# Altium project ZYNQ7020.PrjPcb (part 1 of 3)
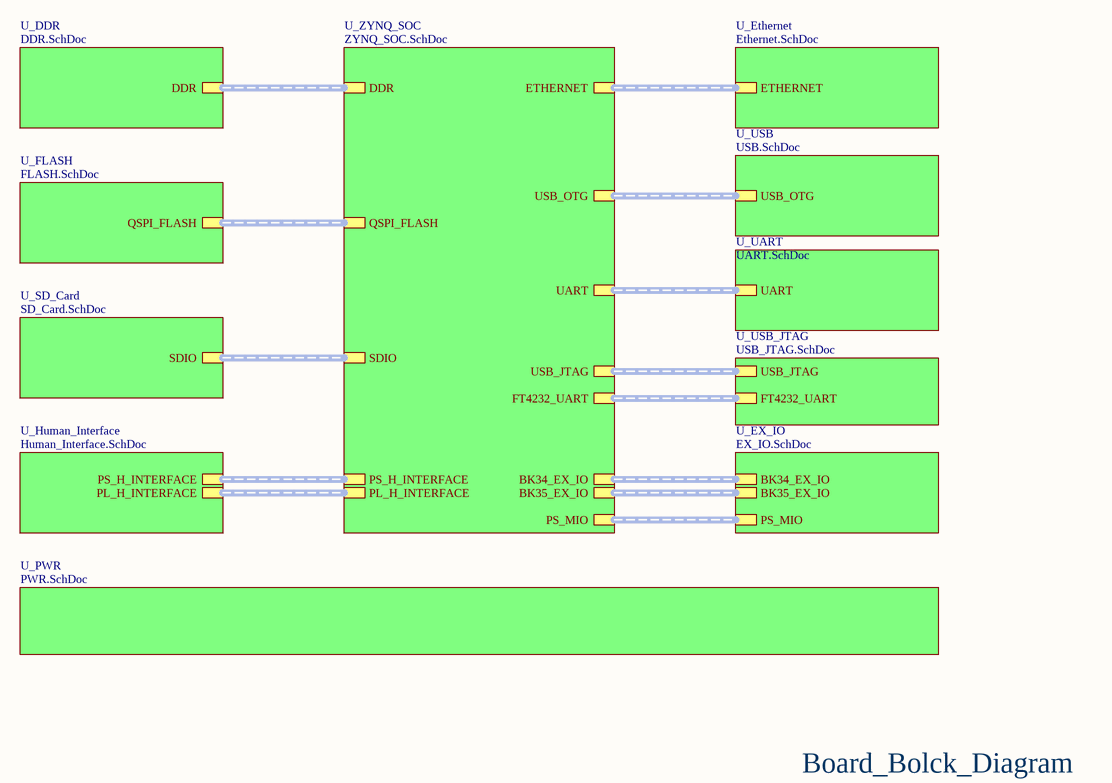
[diagram p0: ZYNQ.SchDoc]
16 sheets, 485 parts. Net scope: hierarchical (ports join the sheet entries above them; power ports are global).
Board file: ZYNQ7020.PcbDoc
Sheets:
  ZYNQ.SchDoc
    U_ZYNQ_SOC = ZYNQ_SOC.SchDoc
      U_ZYNQ_SOC_ARM = ZYNQ_SOC_ARM.SchDoc
      U_ZYNQ_SOC_FPGA = ZYNQ_SOC_FPGA.SchDoc
      U_ZYNQ_SOC_JTAG = ZYNQ_SOC_JTAG.SchDoc
      U_ZYNQ_SOC_PWR = ZYNQ_SOC_PWR.SchDoc
    U_EX_IO = EX_IO.SchDoc
    U_FLASH = FLASH.SchDoc
    U_DDR = DDR.SchDoc
    U_Human_Interface = Human_Interface.SchDoc
    U_UART = UART.SchDoc
    U_SD_Card = SD_Card.SchDoc
    U_PWR = PWR.SchDoc
    U_Ethernet = Ethernet.SchDoc
    U_USB = USB.SchDoc
    U_USB_JTAG = USB_JTAG.SchDoc

## Sheet ZYNQ.SchDoc
size A4

### Sub-sheets
U_DDR = DDR.SchDoc: DDR (harness DDR)
U_Ethernet = Ethernet.SchDoc: ETHERNET (harness ETHERNET)
U_EX_IO = EX_IO.SchDoc: PS_MIO (harness PS_MIO), BK35_EX_IO (harness BK35_EX_IO), BK34_EX_IO (harness BK34_EX_IO)
U_FLASH = FLASH.SchDoc: QSPI_FLASH (harness QSPI_FLASH)
U_Human_Interface = Human_Interface.SchDoc: PS_H_INTERFACE (harness PS_H_INTERFACE), PL_H_INTERFACE (harness PL_H_INTERFACE)
U_PWR = PWR.SchDoc: no entries
U_SD_Card = SD_Card.SchDoc: SDIO (harness SDIO)
U_UART = UART.SchDoc: UART (harness UART)
U_USB = USB.SchDoc: USB_OTG (harness USB_OTG)
U_USB_JTAG = USB_JTAG.SchDoc: FT4232_UART (harness FT4232_UART), USB_JTAG (harness USB_JTAG)
U_ZYNQ_SOC = ZYNQ_SOC.SchDoc: QSPI_FLASH, DDR, PL_H_INTERFACE, UART, PS_H_INTERFACE, SDIO, BK34_EX_IO, PS_MIO, BK35_EX_IO, ETHERNET, USB_OTG, USB_JTAG, FT4232_UART

### Buses and harness runs
harness sheet U_DDR/DDR = sheet U_ZYNQ_SOC/DDR
harness sheet U_Ethernet/ETHERNET = sheet U_ZYNQ_SOC/ETHERNET
harness sheet U_EX_IO/BK34_EX_IO = sheet U_ZYNQ_SOC/BK34_EX_IO
harness sheet U_EX_IO/BK35_EX_IO = sheet U_ZYNQ_SOC/BK35_EX_IO
harness sheet U_EX_IO/PS_MIO = sheet U_ZYNQ_SOC/PS_MIO
harness sheet U_FLASH/QSPI_FLASH = sheet U_ZYNQ_SOC/QSPI_FLASH
harness sheet U_Human_Interface/PL_H_INTERFACE = sheet U_ZYNQ_SOC/PL_H_INTERFACE
harness sheet U_Human_Interface/PS_H_INTERFACE = sheet U_ZYNQ_SOC/PS_H_INTERFACE
harness sheet U_SD_Card/SDIO = sheet U_ZYNQ_SOC/SDIO
harness sheet U_UART/UART = sheet U_ZYNQ_SOC/UART
harness sheet U_USB/USB_OTG = sheet U_ZYNQ_SOC/USB_OTG
harness sheet U_USB_JTAG/FT4232_UART = sheet U_ZYNQ_SOC/FT4232_UART
harness sheet U_USB_JTAG/USB_JTAG = sheet U_ZYNQ_SOC/USB_JTAG

### Notes on the sheet
- Board_Bolck_Diagram

## Sheet ZYNQ_SOC.SchDoc
size A4
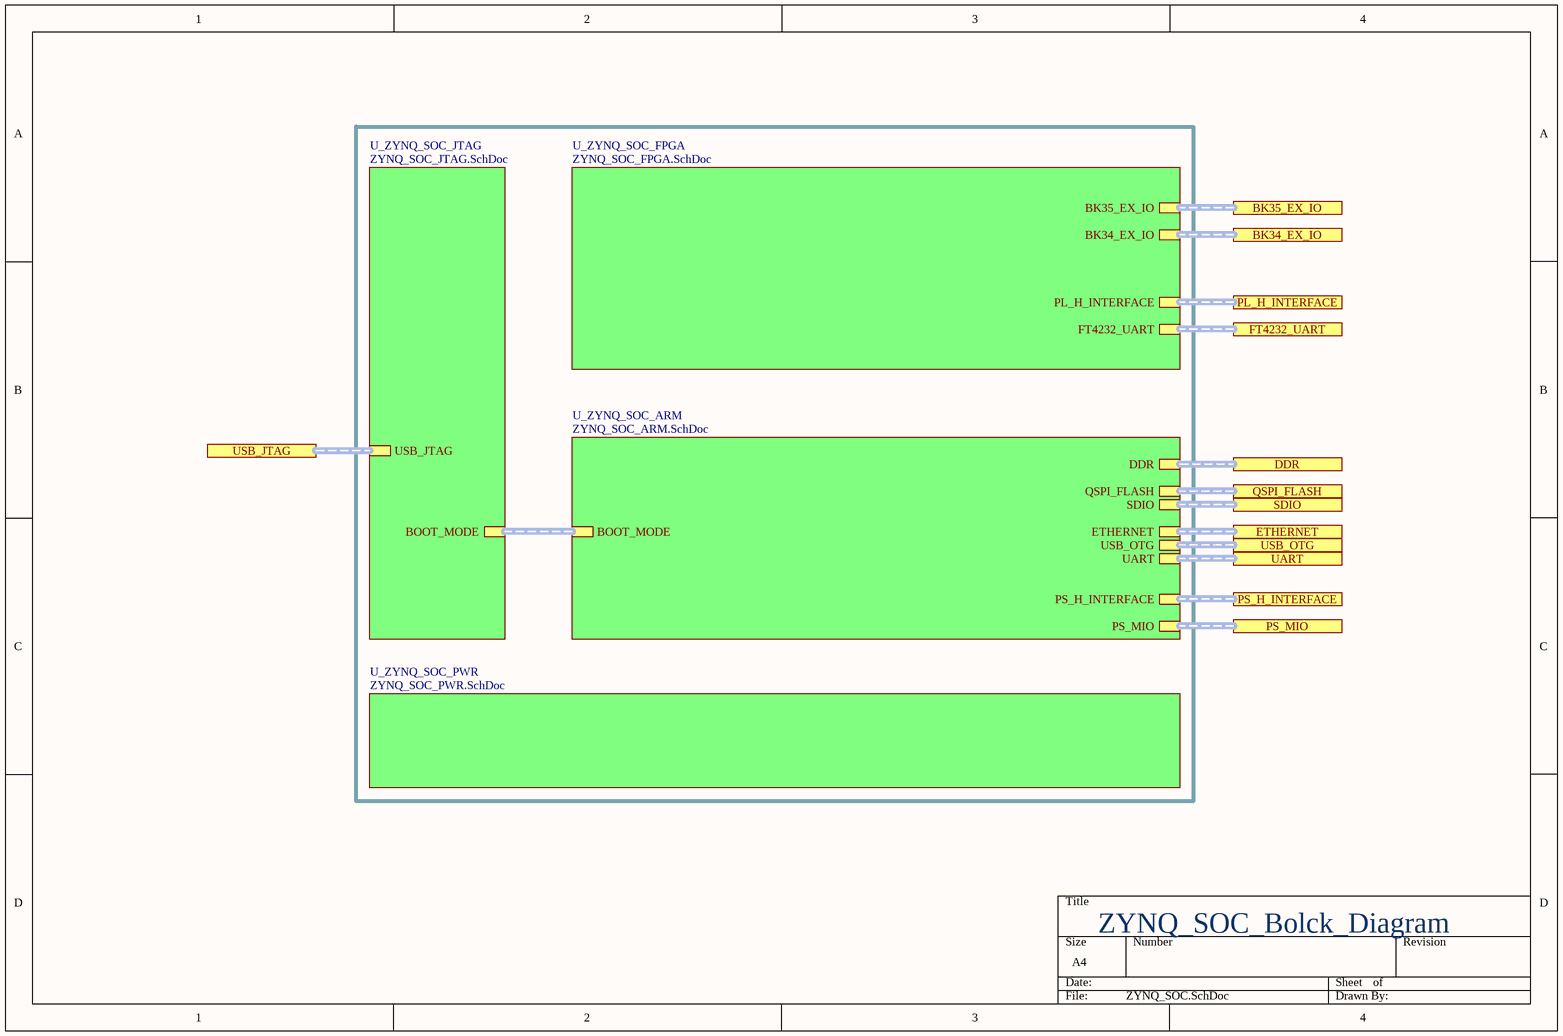
[diagram p1: ZYNQ_SOC.SchDoc]

### Sub-sheets
U_ZYNQ_SOC_ARM = ZYNQ_SOC_ARM.SchDoc: QSPI_FLASH (harness QSPI_FLASH), SDIO (harness SDIO), UART (harness UART), DDR (harness DDR), BOOT_MODE (harness BOOT_MODE), PS_H_INTERFACE (harness PS_H_INTERFACE), PS_MIO (harness PS_MIO), ETHERNET (harness ETHERNET), USB_OTG (harness USB_OTG)
U_ZYNQ_SOC_FPGA = ZYNQ_SOC_FPGA.SchDoc: BK35_EX_IO (harness BK35_EX_IO), BK34_EX_IO (harness BK34_EX_IO), PL_H_INTERFACE (harness PL_H_INTERFACE), FT4232_UART (harness FT4232_UART)
U_ZYNQ_SOC_JTAG = ZYNQ_SOC_JTAG.SchDoc: BOOT_MODE (harness BOOT_MODE), USB_JTAG (harness JTAG)
U_ZYNQ_SOC_PWR = ZYNQ_SOC_PWR.SchDoc: no entries

### Ports
BK34_EX_IO, BK35_EX_IO, DDR, ETHERNET, FT4232_UART, PL_H_INTERFACE, PS_H_INTERFACE, PS_MIO, QSPI_FLASH, SDIO, UART, USB_JTAG, USB_OTG

### Buses and harness runs
harness port BK34_EX_IO = sheet U_ZYNQ_SOC_FPGA/BK34_EX_IO
harness port BK35_EX_IO = sheet U_ZYNQ_SOC_FPGA/BK35_EX_IO
harness port DDR = sheet U_ZYNQ_SOC_ARM/DDR
harness port ETHERNET = sheet U_ZYNQ_SOC_ARM/ETHERNET
harness port FT4232_UART = sheet U_ZYNQ_SOC_FPGA/FT4232_UART
harness port PL_H_INTERFACE = sheet U_ZYNQ_SOC_FPGA/PL_H_INTERFACE
harness port PS_H_INTERFACE = sheet U_ZYNQ_SOC_ARM/PS_H_INTERFACE
harness port PS_MIO = sheet U_ZYNQ_SOC_ARM/PS_MIO
harness port QSPI_FLASH = sheet U_ZYNQ_SOC_ARM/QSPI_FLASH
harness port SDIO = sheet U_ZYNQ_SOC_ARM/SDIO
harness port UART = sheet U_ZYNQ_SOC_ARM/UART
harness port USB_JTAG = sheet U_ZYNQ_SOC_JTAG/USB_JTAG
harness port USB_OTG = sheet U_ZYNQ_SOC_ARM/USB_OTG
harness sheet U_ZYNQ_SOC_ARM/BOOT_MODE = sheet U_ZYNQ_SOC_JTAG/BOOT_MODE

### Notes on the sheet
- ZYNQ_SOC_Bolck_Diagram

## Sheet ZYNQ_SOC_ARM.SchDoc
size A3
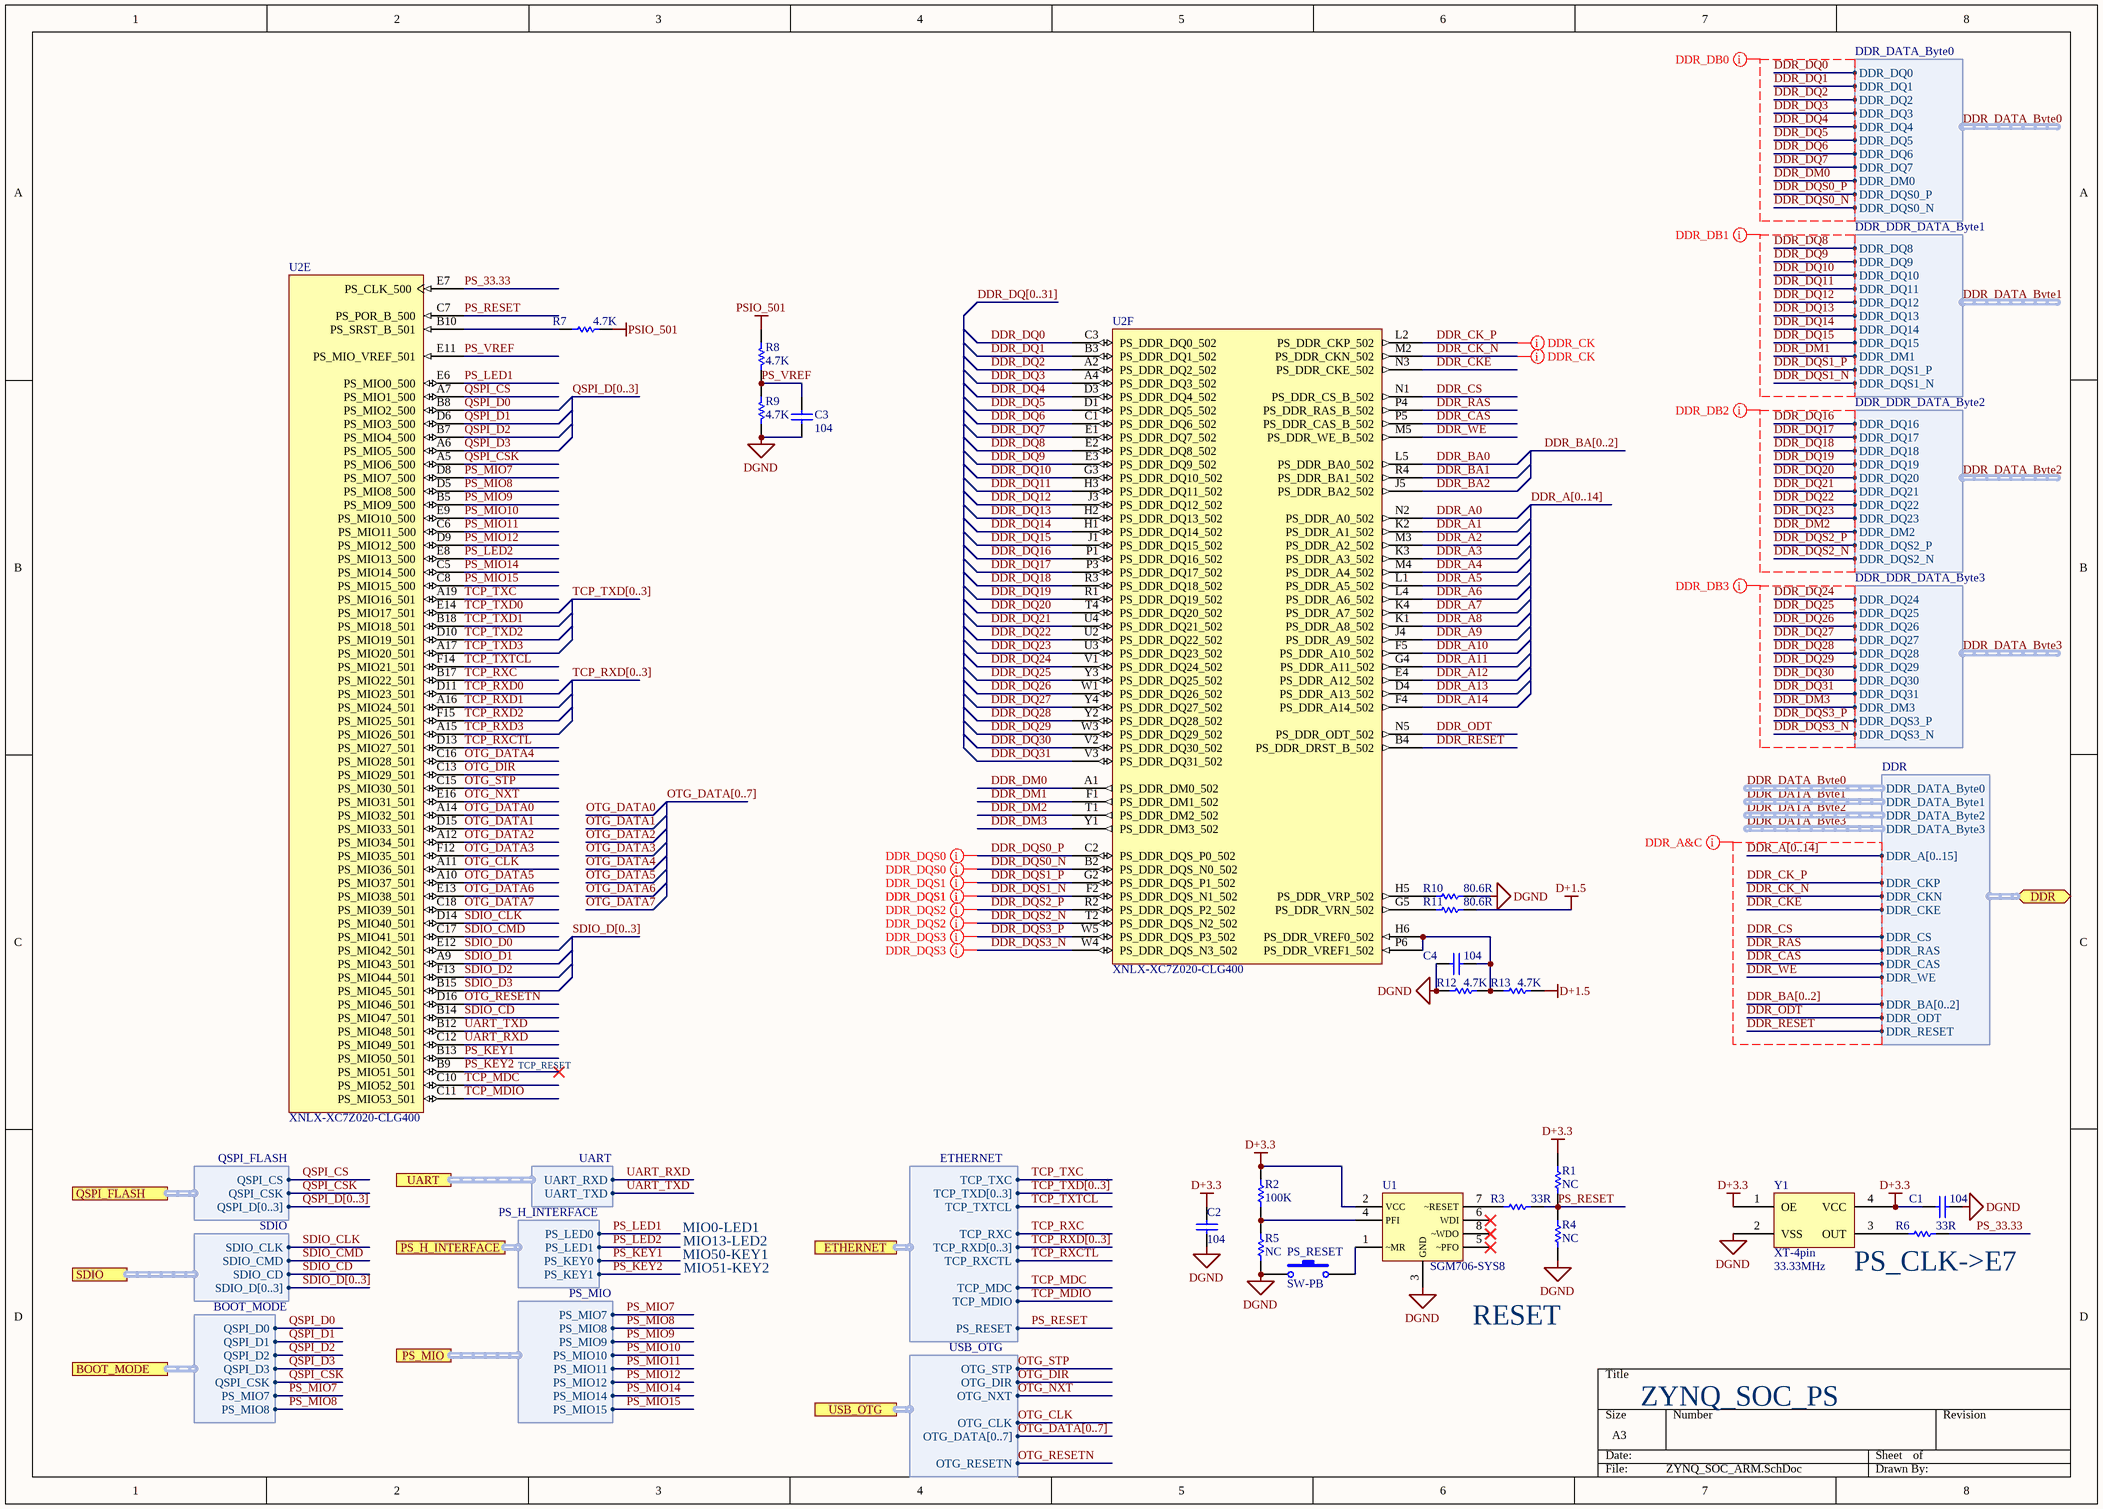
[diagram p2: ZYNQ_SOC_ARM.SchDoc]

### Parts
C1  104  [C 0402_LL]
C2  104  [C 0402_LL]
C3  104  [C 0402_LL]
C4  104  [C 0402_LL]
PS_RESET  SW-PB  [TSW SMD-3*6*4.3]
R1  NC  [R 0402_L]
R2  100K  [R 0603_L]
R3  33R  [R 0603_L]
R4  NC  [R 0402_L]
R5  NC  [R 0402_L]
R6  33R  [R 0603_L]
R7  4.7K  [R 0402_L]
R8  4.7K  [R 0402_L]
R9  4.7K  [R 0402_L]
R10  80.6R  [R 0402_L]
R11  80.6R  [R 0402_L]
R12  4.7K  [R 0402_L]
R13  4.7K  [R 0402_L]
U1  SGM706-SYS8  [SOP8_N]
U2  XNLX-XC7Z020-CLG400  [BGA400]  (parts E,F of 9)
Y1  XT-4pin  value 33.33MHz  [5032(P)]

### Ports
BOOT_MODE (harness BOOT_MODE), DDR (bidir, harness DDR), ETHERNET (harness ETHERNET), PS_H_INTERFACE (harness PS_H_INTERFACE), PS_MIO (harness PS_MIO), QSPI_FLASH (harness QSPI_FLASH), SDIO (harness SDIO), UART (harness UART), USB_OTG (harness USB_OTG)

### Harnesses
QSPI_FLASH: QSPI_CS, QSPI_CSK, QSPI_D[0..3]
SDIO: SDIO_CLK, SDIO_CMD, SDIO_D[0..3], SDIO_CD
UART: UART_RXD, UART_TXD
PS_H_INTERFACE: PS_LED0, PS_LED1, PS_KEY0, PS_KEY1
BOOT_MODE: QSPI_D0, QSPI_D1, QSPI_D3, QSPI_CSK, PS_MIO7, QSPI_D2, PS_MIO8
PS_MIO: PS_MIO7, PS_MIO8, PS_MIO9, PS_MIO10, PS_MIO11, PS_MIO12, PS_MIO14, PS_MIO15
ETHERNET: TCP_TXC, TCP_TXD[0..3], TCP_TXTCL, TCP_RXC, TCP_RXD[0..3], TCP_RXCTL, TCP_MDC, TCP_MDIO, PS_RESET
USB_OTG: OTG_STP, OTG_DIR, OTG_NXT, OTG_CLK, OTG_DATA[0..7], OTG_RESETN
DDR: DDR_A[0..15], DDR_CKP, DDR_CKN, DDR_CKE, DDR_CS, DDR_RAS, DDR_CAS, DDR_WE, DDR_DATA_Byte0, DDR_DATA_Byte1, DDR_DATA_Byte2, DDR_DATA_Byte3, DDR_BA[0..2], DDR_ODT, DDR_RESET
DDR_DDR_DATA_Byte3: DDR_DQ24, DDR_DQ25, DDR_DQ26, DDR_DQ27, DDR_DQ28, DDR_DQ29, DDR_DQ30, DDR_DQ31, DDR_DM3, DDR_DQS3_P, DDR_DQS3_N
DDR_DDR_DATA_Byte2: DDR_DQ16, DDR_DQ17, DDR_DQ18, DDR_DQ19, DDR_DQ20, DDR_DQ21, DDR_DQ22, DDR_DQ23, DDR_DM2, DDR_DQS2_P, DDR_DQS2_N
DDR_DDR_DATA_Byte1: DDR_DQ8, DDR_DQ9, DDR_DQ10, DDR_DQ11, DDR_DQ12, DDR_DQ13, DDR_DQ14, DDR_DQ15, DDR_DM1, DDR_DQS1_P, DDR_DQS1_N
DDR_DATA_Byte0: DDR_DQ0, DDR_DQ1, DDR_DQ2, DDR_DQ3, DDR_DQ4, DDR_DQ5, DDR_DQ6, DDR_DQ7, DDR_DM0, DDR_DQS0_P, DDR_DQS0_N

### Nets
D+1.5: R11.2 R13.2
D+3.3: C1.1 C2.1 R1.2 R2.2 U1.2(VCC) Y1.1(OE) Y1.4(VCC)
DGND: C1.2 C2.2 C3.1 C4.1 PS_RESET.1 R4.1 R5.1 R9.1 R10.2 R12.1 U1.3(GND) Y1.2(VSS)
PSIO_501: R7.2 R8.2  [project net D+1.8_AUX]
DDR_A0: U2.N2(PS_DDR_A0_502)
DDR_A1: U2.K2(PS_DDR_A1_502)
DDR_A2: U2.M3(PS_DDR_A2_502)
DDR_A3: U2.K3(PS_DDR_A3_502)
DDR_A4: U2.M4(PS_DDR_A4_502)
DDR_A5: U2.L1(PS_DDR_A5_502)
DDR_A6: U2.L4(PS_DDR_A6_502)
DDR_A7: U2.K4(PS_DDR_A7_502)
DDR_A8: U2.K1(PS_DDR_A8_502)
DDR_A9: U2.J4(PS_DDR_A9_502)
DDR_A10: U2.F5(PS_DDR_A10_502)
DDR_A11: U2.G4(PS_DDR_A11_502)
DDR_A12: U2.E4(PS_DDR_A12_502)
DDR_A13: U2.D4(PS_DDR_A13_502)
DDR_A14: U2.F4(PS_DDR_A14_502)
DDR_BA0: U2.L5(PS_DDR_BA0_502)
DDR_BA1: U2.R4(PS_DDR_BA1_502)
DDR_BA2: U2.J5(PS_DDR_BA2_502)
DDR_CAS: U2.P5(PS_DDR_CAS_B_502) ; port DDR.DDR_CAS
DDR_CK_N: U2.M2(PS_DDR_CKN_502) ; port DDR.DDR_CKN
DDR_CK_P: U2.L2(PS_DDR_CKP_502) ; port DDR.DDR_CKP
DDR_CKE: U2.N3(PS_DDR_CKE_502) ; port DDR.DDR_CKE
DDR_CS: U2.N1(PS_DDR_CS_B_502) ; port DDR.DDR_CS
DDR_DM0: U2.A1(PS_DDR_DM0_502) ; harness DDR_DATA_Byte0.DDR_DM0  [project net DDR_DATA_Byte0.DDR_DM0]
DDR_DM1: U2.F1(PS_DDR_DM1_502) ; harness DDR_DDR_DATA_Byte1.DDR_DM1  [project net DDR_DATA_Byte1.DDR_DM1]
DDR_DM2: U2.T1(PS_DDR_DM2_502) ; harness DDR_DDR_DATA_Byte2.DDR_DM2  [project net DDR_DATA_Byte2.DDR_DM2]
DDR_DM3: U2.Y1(PS_DDR_DM3_502) ; harness DDR_DDR_DATA_Byte3.DDR_DM3  [project net DDR_DATA_Byte3.DDR_DM3]
DDR_DQ0: U2.C3(PS_DDR_DQ0_502) ; harness DDR_DATA_Byte0.DDR_DQ0  [project net DDR_DATA_Byte0.DDR_DQ0]
DDR_DQ1: U2.B3(PS_DDR_DQ1_502) ; harness DDR_DATA_Byte0.DDR_DQ1  [project net DDR_DATA_Byte0.DDR_DQ1]
DDR_DQ2: U2.A2(PS_DDR_DQ2_502) ; harness DDR_DATA_Byte0.DDR_DQ2  [project net DDR_DATA_Byte0.DDR_DQ2]
DDR_DQ3: U2.A4(PS_DDR_DQ3_502) ; harness DDR_DATA_Byte0.DDR_DQ3  [project net DDR_DATA_Byte0.DDR_DQ3]
DDR_DQ4: U2.D3(PS_DDR_DQ4_502) ; harness DDR_DATA_Byte0.DDR_DQ4  [project net DDR_DATA_Byte0.DDR_DQ4]
DDR_DQ5: U2.D1(PS_DDR_DQ5_502) ; harness DDR_DATA_Byte0.DDR_DQ5  [project net DDR_DATA_Byte0.DDR_DQ5]
DDR_DQ6: U2.C1(PS_DDR_DQ6_502) ; harness DDR_DATA_Byte0.DDR_DQ6  [project net DDR_DATA_Byte0.DDR_DQ6]
DDR_DQ7: U2.E1(PS_DDR_DQ7_502) ; harness DDR_DATA_Byte0.DDR_DQ7  [project net DDR_DATA_Byte0.DDR_DQ7]
DDR_DQ8: U2.E2(PS_DDR_DQ8_502) ; harness DDR_DDR_DATA_Byte1.DDR_DQ8  [project net DDR_DATA_Byte1.DDR_DQ8]
DDR_DQ9: U2.E3(PS_DDR_DQ9_502) ; harness DDR_DDR_DATA_Byte1.DDR_DQ9  [project net DDR_DATA_Byte1.DDR_DQ9]
DDR_DQ10: U2.G3(PS_DDR_DQ10_502) ; harness DDR_DDR_DATA_Byte1.DDR_DQ10  [project net DDR_DATA_Byte1.DDR_DQ10]
DDR_DQ11: U2.H3(PS_DDR_DQ11_502) ; harness DDR_DDR_DATA_Byte1.DDR_DQ11  [project net DDR_DATA_Byte1.DDR_DQ11]
DDR_DQ12: U2.J3(PS_DDR_DQ12_502) ; harness DDR_DDR_DATA_Byte1.DDR_DQ12  [project net DDR_DATA_Byte1.DDR_DQ12]
DDR_DQ13: U2.H2(PS_DDR_DQ13_502) ; harness DDR_DDR_DATA_Byte1.DDR_DQ13  [project net DDR_DATA_Byte1.DDR_DQ13]
DDR_DQ14: U2.H1(PS_DDR_DQ14_502) ; harness DDR_DDR_DATA_Byte1.DDR_DQ14  [project net DDR_DATA_Byte1.DDR_DQ14]
DDR_DQ15: U2.J1(PS_DDR_DQ15_502) ; harness DDR_DDR_DATA_Byte1.DDR_DQ15  [project net DDR_DATA_Byte1.DDR_DQ15]
DDR_DQ16: U2.P1(PS_DDR_DQ16_502) ; harness DDR_DDR_DATA_Byte2.DDR_DQ16  [project net DDR_DATA_Byte2.DDR_DQ16]
DDR_DQ17: U2.P3(PS_DDR_DQ17_502) ; harness DDR_DDR_DATA_Byte2.DDR_DQ17  [project net DDR_DATA_Byte2.DDR_DQ17]
DDR_DQ18: U2.R3(PS_DDR_DQ18_502) ; harness DDR_DDR_DATA_Byte2.DDR_DQ18  [project net DDR_DATA_Byte2.DDR_DQ18]
DDR_DQ19: U2.R1(PS_DDR_DQ19_502) ; harness DDR_DDR_DATA_Byte2.DDR_DQ19  [project net DDR_DATA_Byte2.DDR_DQ19]
DDR_DQ20: U2.T4(PS_DDR_DQ20_502) ; harness DDR_DDR_DATA_Byte2.DDR_DQ20  [project net DDR_DATA_Byte2.DDR_DQ20]
DDR_DQ21: U2.U4(PS_DDR_DQ21_502) ; harness DDR_DDR_DATA_Byte2.DDR_DQ21  [project net DDR_DATA_Byte2.DDR_DQ21]
DDR_DQ22: U2.U2(PS_DDR_DQ22_502) ; harness DDR_DDR_DATA_Byte2.DDR_DQ22  [project net DDR_DATA_Byte2.DDR_DQ22]
DDR_DQ23: U2.U3(PS_DDR_DQ23_502) ; harness DDR_DDR_DATA_Byte2.DDR_DQ23  [project net DDR_DATA_Byte2.DDR_DQ23]
DDR_DQ24: U2.V1(PS_DDR_DQ24_502) ; harness DDR_DDR_DATA_Byte3.DDR_DQ24  [project net DDR_DATA_Byte3.DDR_DQ24]
DDR_DQ25: U2.Y3(PS_DDR_DQ25_502) ; harness DDR_DDR_DATA_Byte3.DDR_DQ25  [project net DDR_DATA_Byte3.DDR_DQ25]
DDR_DQ26: U2.W1(PS_DDR_DQ26_502) ; harness DDR_DDR_DATA_Byte3.DDR_DQ26  [project net DDR_DATA_Byte3.DDR_DQ26]
DDR_DQ27: U2.Y4(PS_DDR_DQ27_502) ; harness DDR_DDR_DATA_Byte3.DDR_DQ27  [project net DDR_DATA_Byte3.DDR_DQ27]
DDR_DQ28: U2.Y2(PS_DDR_DQ28_502) ; harness DDR_DDR_DATA_Byte3.DDR_DQ28  [project net DDR_DATA_Byte3.DDR_DQ28]
DDR_DQ29: U2.W3(PS_DDR_DQ29_502) ; harness DDR_DDR_DATA_Byte3.DDR_DQ29  [project net DDR_DATA_Byte3.DDR_DQ29]
DDR_DQ30: U2.V2(PS_DDR_DQ30_502) ; harness DDR_DDR_DATA_Byte3.DDR_DQ30  [project net DDR_DATA_Byte3.DDR_DQ30]
DDR_DQ31: U2.V3(PS_DDR_DQ31_502) ; harness DDR_DDR_DATA_Byte3.DDR_DQ31  [project net DDR_DATA_Byte3.DDR_DQ31]
DDR_DQS0_N: U2.B2(PS_DDR_DQS_N0_502) ; harness DDR_DATA_Byte0.DDR_DQS0_N  [project net DDR_DATA_Byte0.DDR_DQS0_N]
DDR_DQS0_P: U2.C2(PS_DDR_DQS_P0_502) ; harness DDR_DATA_Byte0.DDR_DQS0_P  [project net DDR_DATA_Byte0.DDR_DQS0_P]
DDR_DQS1_N: U2.F2(PS_DDR_DQS_N1_502) ; harness DDR_DDR_DATA_Byte1.DDR_DQS1_N  [project net DDR_DATA_Byte1.DDR_DQS1_N]
DDR_DQS1_P: U2.G2(PS_DDR_DQS_P1_502) ; harness DDR_DDR_DATA_Byte1.DDR_DQS1_P  [project net DDR_DATA_Byte1.DDR_DQS1_P]
DDR_DQS2_N: U2.T2(PS_DDR_DQS_N2_502) ; harness DDR_DDR_DATA_Byte2.DDR_DQS2_N  [project net DDR_DATA_Byte2.DDR_DQS2_N]
DDR_DQS2_P: U2.R2(PS_DDR_DQS_P2_502) ; harness DDR_DDR_DATA_Byte2.DDR_DQS2_P  [project net DDR_DATA_Byte2.DDR_DQS2_P]
DDR_DQS3_N: U2.W4(PS_DDR_DQS_N3_502) ; harness DDR_DDR_DATA_Byte3.DDR_DQS3_N  [project net DDR_DATA_Byte3.DDR_DQS3_N]
DDR_DQS3_P: U2.W5(PS_DDR_DQS_P3_502) ; harness DDR_DDR_DATA_Byte3.DDR_DQS3_P  [project net DDR_DATA_Byte3.DDR_DQS3_P]
DDR_ODT: U2.N5(PS_DDR_ODT_502) ; port DDR.DDR_ODT
DDR_RAS: U2.P4(PS_DDR_RAS_B_502) ; port DDR.DDR_RAS
DDR_RESET: U2.B4(PS_DDR_DRST_B_502) ; port DDR.DDR_RESET
DDR_WE: U2.M5(PS_DDR_WE_B_502) ; port DDR.DDR_WE
OTG_CLK: U2.A11(PS_MIO36_501) ; port USB_OTG.OTG_CLK
OTG_DATA0: U2.A14(PS_MIO32_501)
OTG_DATA1: U2.D15(PS_MIO33_501)
OTG_DATA2: U2.A12(PS_MIO34_501)
OTG_DATA3: U2.F12(PS_MIO35_501)
OTG_DATA4: U2.C16(PS_MIO28_501)
OTG_DATA5: U2.A10(PS_MIO37_501)
OTG_DATA6: U2.E13(PS_MIO38_501)
OTG_DATA7: U2.C18(PS_MIO39_501)
OTG_DIR: U2.C13(PS_MIO29_501) ; port USB_OTG.OTG_DIR
OTG_NXT: U2.E16(PS_MIO31_501) ; port USB_OTG.OTG_NXT
OTG_RESETN: U2.D16(PS_MIO46_501) ; port USB_OTG.OTG_RESETN
OTG_STP: U2.C15(PS_MIO30_501) ; port USB_OTG.OTG_STP
PS_33.33: R6.2 U2.E7(PS_CLK_500)
PS_KEY1: U2.B13(PS_MIO50_501) ; port PS_H_INTERFACE.PS_KEY0
PS_KEY2: U2.B9(PS_MIO51_501) ; port PS_H_INTERFACE.PS_KEY1
PS_LED1: U2.E6(PS_MIO0_500) ; port PS_H_INTERFACE.PS_LED0
PS_LED2: U2.E8(PS_MIO13_500) ; port PS_H_INTERFACE.PS_LED1
PS_MIO7: U2.D8(PS_MIO7_500) ; port BOOT_MODE.PS_MIO7, port PS_MIO.PS_MIO7
PS_MIO8: U2.D5(PS_MIO8_500) ; port BOOT_MODE.PS_MIO8, port PS_MIO.PS_MIO8
PS_MIO9: U2.B5(PS_MIO9_500) ; port PS_MIO.PS_MIO9
PS_MIO10: U2.E9(PS_MIO10_500) ; port PS_MIO.PS_MIO10
PS_MIO11: U2.C6(PS_MIO11_500) ; port PS_MIO.PS_MIO11
PS_MIO12: U2.D9(PS_MIO12_500) ; port PS_MIO.PS_MIO12
PS_MIO14: U2.C5(PS_MIO14_500) ; port PS_MIO.PS_MIO14
PS_MIO15: U2.C8(PS_MIO15_500) ; port PS_MIO.PS_MIO15
PS_RESET: R1.1 R3.2 R4.2 U2.C7(PS_POR_B_500) ; port ETHERNET.PS_RESET
PS_VREF: C3.2 R8.1 R9.2 U2.E11(PS_MIO_VREF_501)
QSPI_CS: U2.A7(PS_MIO1_500) ; port QSPI_FLASH.QSPI_CS
QSPI_CSK: U2.A5(PS_MIO6_500) ; port QSPI_FLASH.QSPI_CSK, port BOOT_MODE.QSPI_CSK
QSPI_D0: U2.B8(PS_MIO2_500) ; port BOOT_MODE.QSPI_D0
QSPI_D1: U2.D6(PS_MIO3_500) ; port BOOT_MODE.QSPI_D1
QSPI_D2: U2.B7(PS_MIO4_500) ; port BOOT_MODE.QSPI_D2
QSPI_D3: U2.A6(PS_MIO5_500) ; port BOOT_MODE.QSPI_D3
SDIO_CD: U2.B14(PS_MIO47_501) ; port SDIO.SDIO_CD
SDIO_CLK: U2.D14(PS_MIO40_501) ; port SDIO.SDIO_CLK
SDIO_CMD: U2.C17(PS_MIO41_501) ; port SDIO.SDIO_CMD
SDIO_D0: U2.E12(PS_MIO42_501)
SDIO_D1: U2.A9(PS_MIO43_501)
SDIO_D2: U2.F13(PS_MIO44_501)
SDIO_D3: U2.B15(PS_MIO45_501)
TCP_MDC: U2.C10(PS_MIO52_501) ; port ETHERNET.TCP_MDC
TCP_MDIO: U2.C11(PS_MIO53_501) ; port ETHERNET.TCP_MDIO
TCP_RXC: U2.B17(PS_MIO22_501) ; port ETHERNET.TCP_RXC
TCP_RXCTL: U2.D13(PS_MIO27_501) ; port ETHERNET.TCP_RXCTL
TCP_RXD0: U2.D11(PS_MIO23_501)
TCP_RXD1: U2.A16(PS_MIO24_501)
TCP_RXD2: U2.F15(PS_MIO25_501)
TCP_RXD3: U2.A15(PS_MIO26_501)
TCP_TXC: U2.A19(PS_MIO16_501) ; port ETHERNET.TCP_TXC
TCP_TXD0: U2.E14(PS_MIO17_501)
TCP_TXD1: U2.B18(PS_MIO18_501)
TCP_TXD2: U2.D10(PS_MIO19_501)
TCP_TXD3: U2.A17(PS_MIO20_501)
TCP_TXTCL: U2.F14(PS_MIO21_501) ; port ETHERNET.TCP_TXTCL
UART_RXD: U2.C12(PS_MIO49_501) ; port UART.UART_RXD
UART_TXD: U2.B12(PS_MIO48_501) ; port UART.UART_TXD
NetC4_2: C4.2 R12.2 R13.1 U2.H6(PS_DDR_VREF0_502) U2.P6(PS_DDR_VREF1_502)
NetPS_RESET_2: PS_RESET.2 U1.1(~MR)
NetR2_1: R2.1 R5.2 U1.4(PFI)
NetR3_1: R3.1 U1.7(~RESET)
NetR6_1: R6.1 Y1.3(OUT)
NetR7_1: R7.1 U2.B10(PS_SRST_B_501)
NetR10_1: R10.1 U2.H5(PS_DDR_VRP_502)
NetR11_1: R11.1 U2.G5(PS_DDR_VRN_502)

Not connected (* = marked no-connect by the designer): U1 5(~PFO)* 6(WDI)* 8(~WDO)*

### Buses and harness runs
bus DDR_A[0..14]
bus DDR_BA[0..2]
bus DDR_DQ[0..31]
bus OTG_DATA[0..7]
bus QSPI_D[0..3]
bus SDIO_D[0..3]
bus TCP_RXD[0..3]
bus TCP_TXD[0..3]

### Layout directives
differential pair; differential pair class DDR_DQS0: DDR_CK_N, DDR_CK_P, DDR_DATA_Byte0.DDR_DQS0_N, DDR_DATA_Byte0.DDR_DQS0_P
differential pair; differential pair class DDR_DQS1: DDR_DATA_Byte1.DDR_DQS1_N, DDR_DATA_Byte1.DDR_DQS1_P
differential pair; differential pair class DDR_DQS2: DDR_DATA_Byte2.DDR_DQS2_N, DDR_DATA_Byte2.DDR_DQS2_P
differential pair; differential pair class DDR_DQS3: DDR_DATA_Byte3.DDR_DQS3_N, DDR_DATA_Byte3.DDR_DQS3_P
net class DDR_DB0: DDR_DM0, DDR_DQ0, DDR_DQ1, DDR_DQ2, DDR_DQ3, DDR_DQ4, DDR_DQ5, DDR_DQ6, DDR_DQ7, DDR_DQS0_N, DDR_DQS0_P
net class DDR_DB1: DDR_DM1, DDR_DQ8, DDR_DQ9, DDR_DQ10, DDR_DQ11, DDR_DQ12, DDR_DQ13, DDR_DQ14, DDR_DQ15, DDR_DQS1_N, DDR_DQS1_P
net class DDR_DB2: DDR_DM2, DDR_DQ16, DDR_DQ17, DDR_DQ18, DDR_DQ19, DDR_DQ20, DDR_DQ21, DDR_DQ22, DDR_DQ23, DDR_DQS2_N, DDR_DQS2_P
net class DDR_DB3: DDR_DM3, DDR_DQ24, DDR_DQ25, DDR_DQ26, DDR_DQ27, DDR_DQ28, DDR_DQ29, DDR_DQ30, DDR_DQ31, DDR_DQS3_N, DDR_DQS3_P
net class DDR_A&C: DDR_A[0..14], DDR_BA[0..2], DDR_CAS, DDR_CK_N, DDR_CK_P, DDR_CKE, DDR_CS, DDR_ODT, DDR_RAS, DDR_RESET, DDR_WE

### Notes on the sheet
- TCP_RESET
- MIO0-LED1
- MIO13-LED2
- MIO50-KEY1
- MIO51-KEY2
- PS_CLK->E7
- RESET
- ZYNQ_SOC_PS

### Library data of the parts
C1-C4 = Cap: Capacitor; Published: 8-Jun-2000; LatestRevisionDate: 17-Jul-2002; LatestRevisionNote: Re-released for DXP Platform.; PackageReference: RAD-0.3; Publisher: Altium Limited; PackageDescription: Radial Cap, Thru-Hole; 2 Leads; 0.3 in Pin Spacing
PS_RESET = SW-PB: Switch; Published: 24-Mar-1999; LatestRevisionDate: 17-Jul-2002; LatestRevisionNote: Re-released for DXP Platform.; PackageReference: SPST-2; Publisher: Altium Limited; PackageDescription: Switch; 2 Leads
R1-R13 = Res1: Resistor; Value: 1K; Published: 8-Jun-2000; LatestRevisionDate: 17-Jul-2002; LatestRevisionNote: Re-released for DXP Platform.; PackageReference: AXIAL-0.3; Publisher: Altium Limited; PackageDescription: Axial Device, Thru-Hole; 2 Leads; 0.3 in Pin Spacing
U1 = SGM706: power supply monitoring circuitry for power on time.
U2 = XNLX-XC7Z020-CLG400: xilinx双核A9处理器与FPGA集成的SoC; Manufacturer: xilinx; value: NC
Y1 = XT-4pin: 有源晶振; Manufacturer: NC

## Sheet ZYNQ_SOC_FPGA.SchDoc
size A4
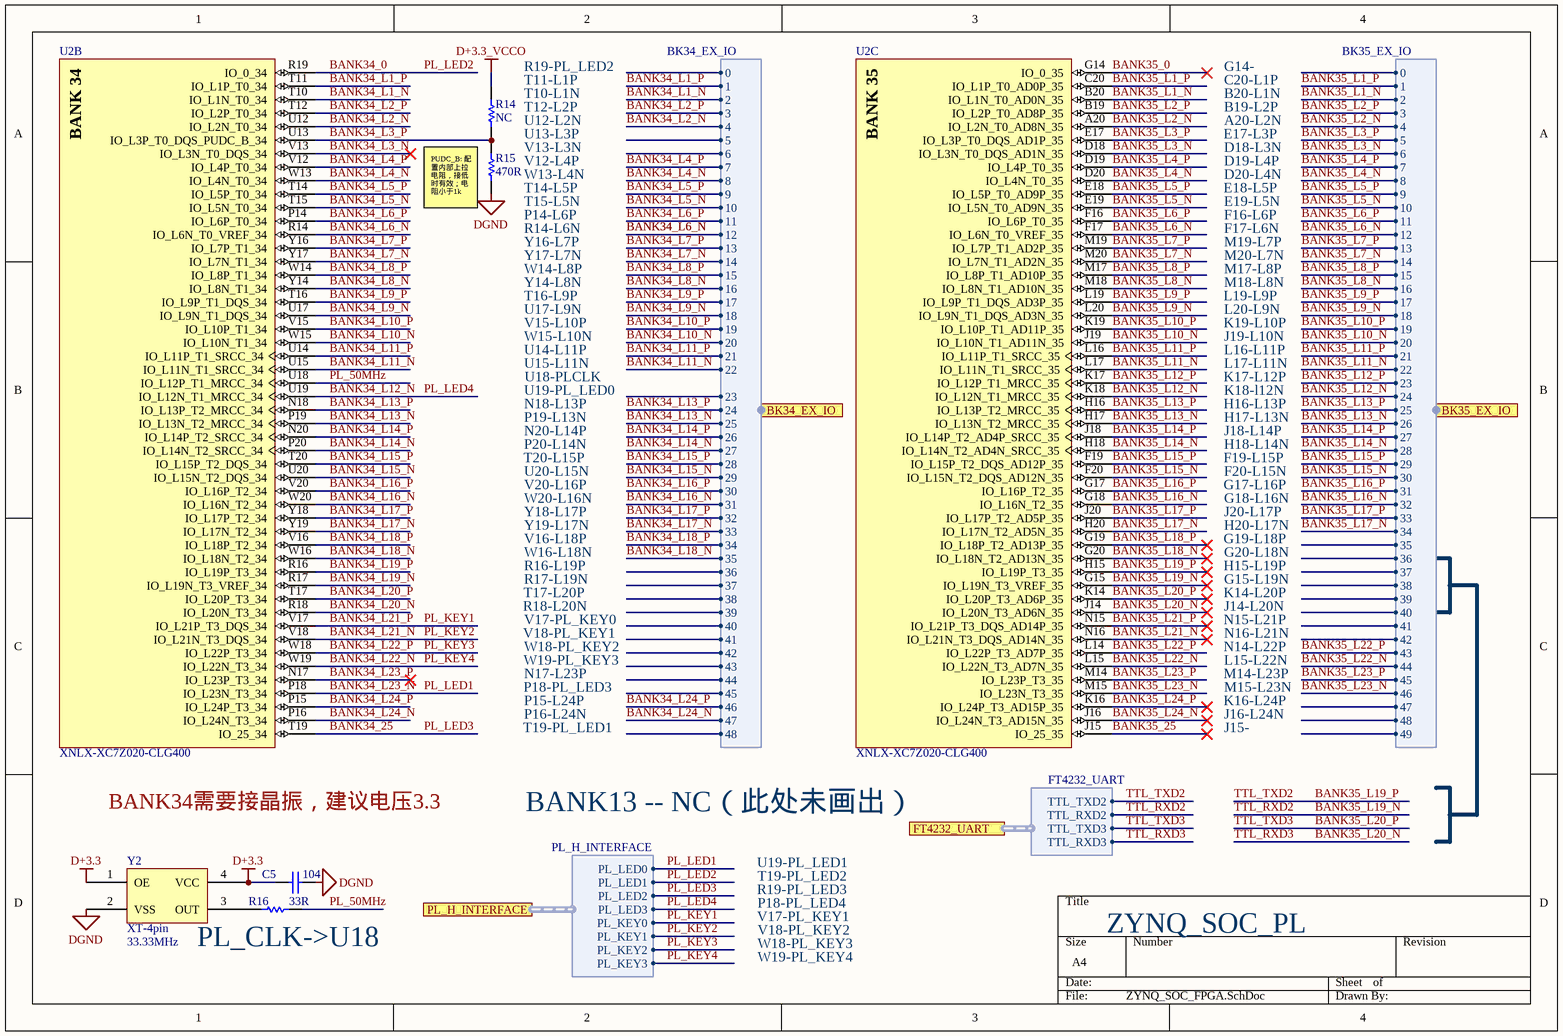
[diagram p3: ZYNQ_SOC_FPGA.SchDoc]

### Parts
C5  104  [C 0402_LL]
R14  NC  [R 0402_L]
R15  470R  [R 0402_L]
R16  33R  [R 0603_L]
U2  XNLX-XC7Z020-CLG400  [BGA400]  (parts B,C of 9)
Y2  XT-4pin  value 33.33MHz  [5032(P)]

### Ports
BK34_EX_IO (harness BK34_EX_IO), BK35_EX_IO (harness BK35_EX_IO), FT4232_UART (harness FT4232_UART), PL_H_INTERFACE (harness PL_H_INTERFACE)

### Harnesses
BK35_EX_IO: 0, 1, 2, 3, 4, 5, 6, 7, 8, 9, 10, 11, 12, 13, 14, 15, 16, 17, 18, 19, 20, 21, 22, 23, 24, 25, 26, 27, 28, 29, 30, 31, 32, 33, 34, 35, 36, 37, 38, 39, 40, 41, 42, 43, 44, 45, 46, 47, 48, 49
BK34_EX_IO: 0, 1, 2, 3, 4, 5, 6, 7, 8, 9, 10, 11, 12, 13, 14, 15, 16, 17, 18, 19, 20, 21, 22, 23, 24, 25, 26, 27, 28, 29, 30, 31, 32, 33, 34, 35, 36, 37, 38, 39, 40, 41, 42, 43, 44, 45, 46, 47, 48
PL_H_INTERFACE: PL_LED0, PL_LED1, PL_KEY0, PL_KEY1, PL_LED2, PL_LED3, PL_KEY2, PL_KEY3
FT4232_UART: TTL_TXD2, TTL_RXD2, TTL_RXD3, TTL_TXD3

### Nets
D+3.3: C5.1 Y2.1(OE) Y2.4(VCC)
D+3.3_VCCO: R14.2  [project net D+3.3_PS]
DGND: C5.2 R15.1 Y2.2(VSS)
BANK34_0: U2.R19(IO_0_34) ; port PL_H_INTERFACE.PL_LED1  [also labelled PL_LED2]
BANK34_25: U2.T19(IO_25_34) ; port PL_H_INTERFACE.PL_LED2  [also labelled PL_LED3]
BANK34_L1_N: U2.T10(IO_L1N_T0_34) ; port BK34_EX_IO.2
BANK34_L1_P: U2.T11(IO_L1P_T0_34) ; port BK34_EX_IO.1
BANK34_L2_N: U2.U12(IO_L2N_T0_34) ; port BK34_EX_IO.4
BANK34_L2_P: U2.T12(IO_L2P_T0_34) ; port BK34_EX_IO.3
BANK34_L3_N: U2.V13(IO_L3N_T0_DQS_34)
BANK34_L3_P: R14.1 R15.2 U2.U13(IO_L3P_T0_DQS_PUDC_B_34)
BANK34_L4_N: U2.W13(IO_L4N_T0_34) ; port BK34_EX_IO.8
BANK34_L4_P: U2.V12(IO_L4P_T0_34) ; port BK34_EX_IO.7
BANK34_L5_N: U2.T15(IO_L5N_T0_34) ; port BK34_EX_IO.10
BANK34_L5_P: U2.T14(IO_L5P_T0_34) ; port BK34_EX_IO.9
BANK34_L6_N: U2.R14(IO_L6N_T0_VREF_34) ; port BK34_EX_IO.12
BANK34_L6_P: U2.P14(IO_L6P_T0_34) ; port BK34_EX_IO.11
BANK34_L7_N: U2.Y17(IO_L7N_T1_34) ; port BK34_EX_IO.14
BANK34_L7_P: U2.Y16(IO_L7P_T1_34) ; port BK34_EX_IO.13
BANK34_L8_N: U2.Y14(IO_L8N_T1_34) ; port BK34_EX_IO.16
BANK34_L8_P: U2.W14(IO_L8P_T1_34) ; port BK34_EX_IO.15
BANK34_L9_N: U2.U17(IO_L9N_T1_DQS_34) ; port BK34_EX_IO.18
BANK34_L9_P: U2.T16(IO_L9P_T1_DQS_34) ; port BK34_EX_IO.17
BANK34_L10_N: U2.W15(IO_L10N_T1_34) ; port BK34_EX_IO.20
BANK34_L10_P: U2.V15(IO_L10P_T1_34) ; port BK34_EX_IO.19
BANK34_L11_N: U2.U15(IO_L11N_T1_SRCC_34) ; port BK34_EX_IO.22
BANK34_L11_P: U2.U14(IO_L11P_T1_SRCC_34) ; port BK34_EX_IO.21
BANK34_L12_N: U2.U19(IO_L12N_T1_MRCC_34) ; port PL_H_INTERFACE.PL_LED3  [also labelled PL_LED4]
BANK34_L13_N: U2.P19(IO_L13N_T2_MRCC_34) ; port BK34_EX_IO.25
BANK34_L13_P: U2.N18(IO_L13P_T2_MRCC_34) ; port BK34_EX_IO.24
BANK34_L14_N: U2.P20(IO_L14N_T2_SRCC_34) ; port BK34_EX_IO.27
BANK34_L14_P: U2.N20(IO_L14P_T2_SRCC_34) ; port BK34_EX_IO.26
BANK34_L15_N: U2.U20(IO_L15N_T2_DQS_34) ; port BK34_EX_IO.29
BANK34_L15_P: U2.T20(IO_L15P_T2_DQS_34) ; port BK34_EX_IO.28
BANK34_L16_N: U2.W20(IO_L16N_T2_34) ; port BK34_EX_IO.31
BANK34_L16_P: U2.V20(IO_L16P_T2_34) ; port BK34_EX_IO.30
BANK34_L17_N: U2.Y19(IO_L17N_T2_34) ; port BK34_EX_IO.33
BANK34_L17_P: U2.Y18(IO_L17P_T2_34) ; port BK34_EX_IO.32
BANK34_L18_N: U2.W16(IO_L18N_T2_34) ; port BK34_EX_IO.35
BANK34_L18_P: U2.V16(IO_L18P_T2_34) ; port BK34_EX_IO.34
BANK34_L19_N: U2.R17(IO_L19N_T3_VREF_34)
BANK34_L19_P: U2.R16(IO_L19P_T3_34)
BANK34_L20_N: U2.R18(IO_L20N_T3_34)
BANK34_L20_P: U2.T17(IO_L20P_T3_34)
BANK34_L21_N: U2.V18(IO_L21N_T3_DQS_34) ; port PL_H_INTERFACE.PL_KEY1  [also labelled PL_KEY2]
BANK34_L21_P: U2.V17(IO_L21P_T3_DQS_34) ; port PL_H_INTERFACE.PL_KEY0  [also labelled PL_KEY1]
BANK34_L22_N: U2.W19(IO_L22N_T3_34) ; port PL_H_INTERFACE.PL_KEY3  [also labelled PL_KEY4]
BANK34_L22_P: U2.W18(IO_L22P_T3_34) ; port PL_H_INTERFACE.PL_KEY2  [also labelled PL_KEY3]
BANK34_L23_N: U2.P18(IO_L23N_T3_34) ; port PL_H_INTERFACE.PL_LED0  [also labelled PL_LED1]
BANK34_L23_P: U2.N17(IO_L23P_T3_34)
BANK34_L24_N: U2.P16(IO_L24N_T3_34) ; port BK34_EX_IO.47
BANK34_L24_P: U2.P15(IO_L24P_T3_34) ; port BK34_EX_IO.46
BANK35_0: U2.G14(IO_0_35)
BANK35_25: U2.J15(IO_25_35)
BANK35_L1_N: U2.B20(IO_L1N_T0_AD0N_35) ; port BK35_EX_IO.2
BANK35_L1_P: U2.C20(IO_L1P_T0_AD0P_35) ; port BK35_EX_IO.1
BANK35_L2_N: U2.A20(IO_L2N_T0_AD8N_35) ; port BK35_EX_IO.4
BANK35_L2_P: U2.B19(IO_L2P_T0_AD8P_35) ; port BK35_EX_IO.3
BANK35_L3_N: U2.D18(IO_L3N_T0_DQS_AD1N_35) ; port BK35_EX_IO.6
BANK35_L3_P: U2.E17(IO_L3P_T0_DQS_AD1P_35) ; port BK35_EX_IO.5
BANK35_L4_N: U2.D20(IO_L4N_T0_35) ; port BK35_EX_IO.8
BANK35_L4_P: U2.D19(IO_L4P_T0_35) ; port BK35_EX_IO.7
BANK35_L5_N: U2.E19(IO_L5N_T0_AD9N_35) ; port BK35_EX_IO.10
BANK35_L5_P: U2.E18(IO_L5P_T0_AD9P_35) ; port BK35_EX_IO.9
BANK35_L6_N: U2.F17(IO_L6N_T0_VREF_35) ; port BK35_EX_IO.12
BANK35_L6_P: U2.F16(IO_L6P_T0_35) ; port BK35_EX_IO.11
BANK35_L7_N: U2.M20(IO_L7N_T1_AD2N_35) ; port BK35_EX_IO.14
BANK35_L7_P: U2.M19(IO_L7P_T1_AD2P_35) ; port BK35_EX_IO.13
BANK35_L8_N: U2.M18(IO_L8N_T1_AD10N_35) ; port BK35_EX_IO.16
BANK35_L8_P: U2.M17(IO_L8P_T1_AD10P_35) ; port BK35_EX_IO.15
BANK35_L9_N: U2.L20(IO_L9N_T1_DQS_AD3N_35) ; port BK35_EX_IO.18
BANK35_L9_P: U2.L19(IO_L9P_T1_DQS_AD3P_35) ; port BK35_EX_IO.17
BANK35_L10_N: U2.J19(IO_L10N_T1_AD11N_35) ; port BK35_EX_IO.20
BANK35_L10_P: U2.K19(IO_L10P_T1_AD11P_35) ; port BK35_EX_IO.19
BANK35_L11_N: U2.L17(IO_L11N_T1_SRCC_35) ; port BK35_EX_IO.22
BANK35_L11_P: U2.L16(IO_L11P_T1_SRCC_35) ; port BK35_EX_IO.21
BANK35_L12_N: U2.K18(IO_L12N_T1_MRCC_35) ; port BK35_EX_IO.24
BANK35_L12_P: U2.K17(IO_L12P_T1_MRCC_35) ; port BK35_EX_IO.23
BANK35_L13_N: U2.H17(IO_L13N_T2_MRCC_35) ; port BK35_EX_IO.26
BANK35_L13_P: U2.H16(IO_L13P_T2_MRCC_35) ; port BK35_EX_IO.25
BANK35_L14_N: U2.H18(IO_L14N_T2_AD4N_SRCC_35) ; port BK35_EX_IO.28
BANK35_L14_P: U2.J18(IO_L14P_T2_AD4P_SRCC_35) ; port BK35_EX_IO.27
BANK35_L15_N: U2.F20(IO_L15N_T2_DQS_AD12N_35) ; port BK35_EX_IO.30
BANK35_L15_P: U2.F19(IO_L15P_T2_DQS_AD12P_35) ; port BK35_EX_IO.29
BANK35_L16_N: U2.G18(IO_L16N_T2_35) ; port BK35_EX_IO.32
BANK35_L16_P: U2.G17(IO_L16P_T2_35) ; port BK35_EX_IO.31
BANK35_L17_N: U2.H20(IO_L17N_T2_AD5N_35) ; port BK35_EX_IO.34
BANK35_L17_P: U2.J20(IO_L17P_T2_AD5P_35) ; port BK35_EX_IO.33
BANK35_L18_N: U2.G20(IO_L18N_T2_AD13N_35)
BANK35_L18_P: U2.G19(IO_L18P_T2_AD13P_35)
BANK35_L19_N: U2.G15(IO_L19N_T3_VREF_35) ; port FT4232_UART.TTL_RXD2  [also labelled TTL_RXD2]
BANK35_L19_P: U2.H15(IO_L19P_T3_35) ; port FT4232_UART.TTL_TXD2  [also labelled TTL_TXD2]
BANK35_L20_N: U2.J14(IO_L20N_T3_AD6N_35) ; port FT4232_UART.TTL_RXD3  [also labelled TTL_RXD3]
BANK35_L20_P: U2.K14(IO_L20P_T3_AD6P_35) ; port FT4232_UART.TTL_TXD3  [also labelled TTL_TXD3]
BANK35_L21_N: U2.N16(IO_L21N_T3_DQS_AD14N_35)
BANK35_L21_P: U2.N15(IO_L21P_T3_DQS_AD14P_35)
BANK35_L22_N: U2.L15(IO_L22N_T3_AD7N_35) ; port BK35_EX_IO.44
BANK35_L22_P: U2.L14(IO_L22P_T3_AD7P_35) ; port BK35_EX_IO.43
BANK35_L23_N: U2.M15(IO_L23N_T3_35) ; port BK35_EX_IO.46
BANK35_L23_P: U2.M14(IO_L23P_T3_35) ; port BK35_EX_IO.45
BANK35_L24_N: U2.J16(IO_L24N_T3_AD15N_35)
BANK35_L24_P: U2.K16(IO_L24P_T3_AD15P_35)
PL_50MHz: R16.2 U2.U18(IO_L12P_T1_MRCC_34)
NetR16_1: R16.1 Y2.3(OUT)

### Notes on the sheet
- (near R14) T11-L1P
- T12-L2P
- (near R14) T10-L1N
- U12-L2N
- (near R14) R19-PL_LED2
- G14-
- B19-L2P
- C20-L1P
- B20-L1N
- A20-L2N
- V12-L4P
- U13-L3P
- V13-L3N
- W13-L4N
- E17-L3P
- D19-L4P
- D18-L3N
- D20-L4N
- (near R15) PUDC_B: 配置内部上拉电阻，接低时有效；电阻小于1k
- (near R15) P14-L6P
- (near R15) T14-L5P
- Y16-L7P
- (near R15) T15-L5N
- (near R15) R14-L6N
- Y17-L7N
- F16-L6P
- E18-L5P
- F17-L6N
- E19-L5N
- M19-L7P
- M20-L7N
- T16-L9P
- Y14-L8N
- U17-L9N
- W14-L8P
- L19-L9P
- L20-L9N
- M17-L8P
- M18-L8N
- V15-L10P
- U14-L11P
- U15-L11N
- W15-L10N
- U18-PLCLK
- U19-PL_LED0
- J19-L10N
- K18-l12N
- L16-L11P
- K19-L10P
- K17-L12P
- L17-L11N
- N18-L13P
- N20-L14P
- P19-L13N
- P20-L14N
- J18-L14P
- H16-L13P
- H17-L13N
- H18-L14N
- T20-L15P
- V20-L16P
- Y18-L17P
- U20-L15N
- Y19-L17N
- W20-L16N
- J20-L17P
- F19-L15P
- G17-L16P
- F20-L15N
- G18-L16N
- H20-L17N
- R16-L19P
- V16-L18P
- R17-L19N
- W16-L18N
- G19-L18P
- H15-L19P
- G20-L18N
- G15-L19N
- T17-L20P
- R18-L20N
- V18-PL_KEY1
- V17-PL_KEY0
- W19-PL_KEY3
- W18-PL_KEY2
- J14-L20N
- K14-L20P
- N15-L21P
- N14-L22P
- L15-L22N
- N16-L21N
- P15-L24P
- N17-L23P
- P16-L24N
- P18-PL_LED3
- J16-L24N
- K16-L24P
- M14-L23P
- M15-L23N
- T19-PL_LED1
- J15-
- BANK34需要接晶振，建议电压3.3
- BANK13 -- NC（此处未画出）
- P18-PL_LED4
- T19-PL_LED2
- R19-PL_LED3
- U19-PL_LED1
- V17-PL_KEY1
- V18-PL_KEY2
- ZYNQ_SOC_PL
- PL_CLK->U18
- W18-PL_KEY3
- W19-PL_KEY4
- (in symbol XNLX-XC7Z020-CLG400, part B) BANK 34
- (in symbol XNLX-XC7Z020-CLG400, part C) BANK 35

### Library data of the parts
C5 = Cap: Capacitor; Published: 8-Jun-2000; LatestRevisionDate: 17-Jul-2002; LatestRevisionNote: Re-released for DXP Platform.; PackageReference: RAD-0.3; Publisher: Altium Limited; PackageDescription: Radial Cap, Thru-Hole; 2 Leads; 0.3 in Pin Spacing
R14-R16 = Res1: Resistor; Value: 1K; Published: 8-Jun-2000; LatestRevisionDate: 17-Jul-2002; LatestRevisionNote: Re-released for DXP Platform.; PackageReference: AXIAL-0.3; Publisher: Altium Limited; PackageDescription: Axial Device, Thru-Hole; 2 Leads; 0.3 in Pin Spacing
U2 = XNLX-XC7Z020-CLG400: as U2 on sheet ZYNQ_SOC_ARM
Y2 = XT-4pin: 有源晶振; Manufacturer: NC

## Sheet ZYNQ_SOC_JTAG.SchDoc
size A4
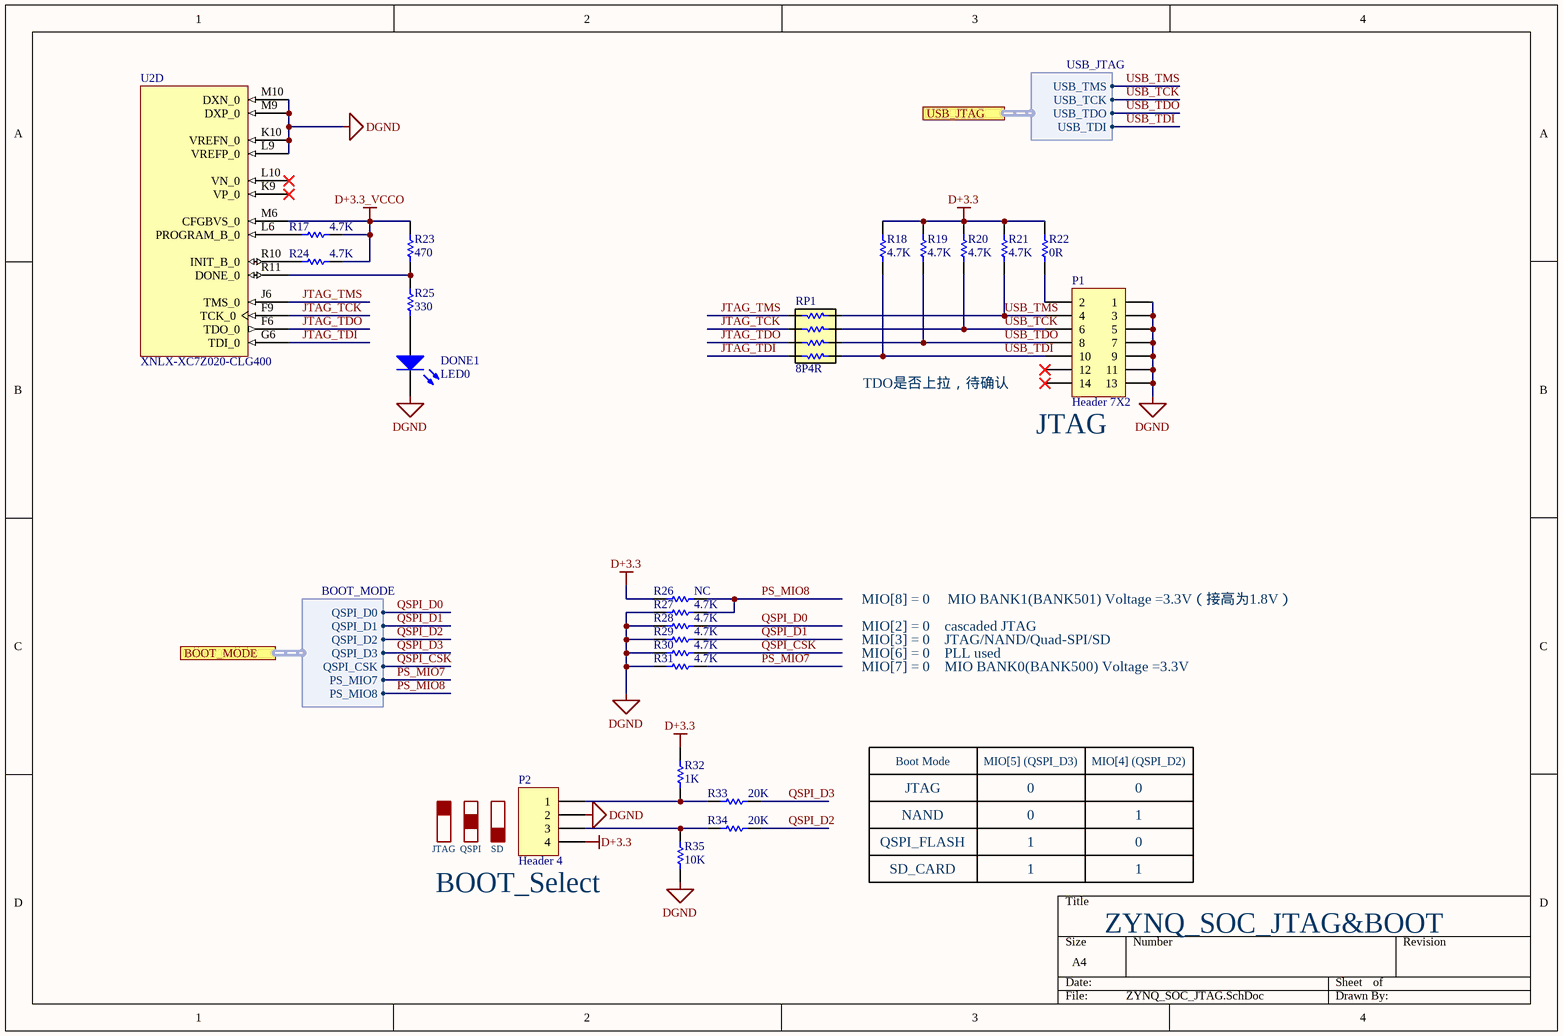
[diagram p4: ZYNQ_SOC_JTAG.SchDoc]

### Parts
DONE1  LED0  [LED 0603G]
P1  Header 7X2  [IDC2.54-LI-2x7P]
P2  Header 4  [HDR1X4]
R17  4.7K  [R 0402_L]
R18  4.7K  [R 0603_L]
R19  4.7K  [R 0603_L]
R20  4.7K  [R 0603_L]
R21  4.7K  [R 0603_L]
R22  0R  [R 0603_L]
R23  470  [R 0603_L]
R24  4.7K  [R 0402_L]
R25  330  [R 0603_L]
R26  NC  [R 0402_L]
R27  4.7K  [R 0402_L]
R28  4.7K  [R 0402_L]
R29  4.7K  [R 0402_L]
R30  4.7K  [R 0402_L]
R31  4.7K  [R 0402_L]
R32  1K  [R 0603_L]
R33  20K  [R 0603_L]
R34  20K  [R 0603_L]
R35  10K  [R 0603_L]
RP1  8P4R  [8P4R]
U2  XNLX-XC7Z020-CLG400  [BGA400]  (part D of 9)

### Ports
BOOT_MODE (harness BOOT_MODE), USB_JTAG (harness USB_JTAG)

### Harnesses
BOOT_MODE: QSPI_D0, QSPI_D1, QSPI_D3, QSPI_CSK, PS_MIO7, QSPI_D2, PS_MIO8
USB_JTAG: USB_TMS, USB_TCK, USB_TDI, USB_TDO

### Nets
D+3.3: P2.4 R18.2 R19.2 R20.2 R21.2 R22.2 R26.1 R32.2
D+3.3_VCCO: R17.2 R23.2 R24.2 U2.M6(CFGBVS_0)  [project net D+3.3_PS]
DGND: DONE1.2(K) P1.1 P1.3 P1.5 P1.7 P1.9 P1.11 P1.13 P2.2 R27.1 R28.1 R29.1 R30.1 R31.1 R35.1 U2.K10(VREFN_0) U2.L9(VREFP_0) U2.M9(DXP_0) U2.M10(DXN_0)
JTAG_TCK: RP1.3 U2.F9(TCK_0)
JTAG_TDI: RP1.1 U2.G6(TDI_0)
JTAG_TDO: RP1.2 U2.F6(TDO_0)
JTAG_TMS: RP1.4 U2.J6(TMS_0)
PS_MIO7: R31.2 ; port BOOT_MODE.PS_MIO7
PS_MIO8: R26.2 R27.2 ; port BOOT_MODE.PS_MIO8
QSPI_CSK: R30.2 ; port BOOT_MODE.QSPI_CSK
QSPI_D0: R28.2 ; port BOOT_MODE.QSPI_D0
QSPI_D1: R29.2 ; port BOOT_MODE.QSPI_D1
QSPI_D2: R34.2 ; port BOOT_MODE.QSPI_D2
QSPI_D3: R33.2 ; port BOOT_MODE.QSPI_D3
USB_TCK: P1.6 R20.1 RP1.7 ; port USB_JTAG.USB_TCK  [project net JTAG_TCK]
USB_TDI: P1.10 R18.1 RP1.5 ; port USB_JTAG.USB_TDI  [project net JTAG_TDI]
USB_TDO: P1.8 R19.1 RP1.6 ; port USB_JTAG.USB_TDO  [project net JTAG_TDO]
USB_TMS: P1.4 R21.1 RP1.8 ; port USB_JTAG.USB_TMS  [project net JTAG_TMS]
NetDONE1_1: DONE1.1(A) R25.1
NetP1_2: P1.2 R22.1
NetP2_1: P2.1 R32.1 R33.1
NetP2_3: P2.3 R34.1 R35.2
NetR17_1: R17.1 U2.L6(PROGRAM_B_0)
NetR23_1: R23.1 R25.2 U2.R11(DONE_0)
NetR24_1: R24.1 U2.R10(INIT_B_0)

Not connected (* = marked no-connect by the designer): P1 12* 14*; U2 K9(VP_0)* L10(VN_0)*

### Notes on the sheet
- TDO是否上拉，待确认
- (near P1) JTAG
- MIO[2] = 0
- MIO[3] = 0
- MIO[6] = 0
- MIO[8] = 0
- PLL used
- cascaded JTAG
- JTAG/NAND/Quad-SPI/SD
- MIO BANK1(BANK501) Voltage =3.3V（接高为1.8V）
- MIO[7] = 0
- MIO BANK0(BANK500) Voltage =3.3V
- Boot Mode
- JTAG
- MIO[5] (QSPI_D3)
- 0
- MIO[4] (QSPI_D2)
- QSPI
- SD
- NAND
- QSPI_FLASH
- 1
- (near P2) BOOT_Select
- SD_CARD
- ZYNQ_SOC_JTAG&BOOT

### Library data of the parts
DONE1 = LED0: Typical INFRARED GaAs LED; Published: 8-Jun-2000; LatestRevisionDate: 08-Jul-2005; LatestRevisionNote: Mech Layer 1 removed.; PackageReference: LED-0; Publisher: Altium Limited; PackageDescription: LED; 2 Leads
P1 = Header 7X2: Header, 7-Pin, Dual row; LatestRevisionDate: 17-Jul-2002; LatestRevisionNote: Re-released for DXP Platform.; Publisher: Altium Limited
P2 = Header 4: Header, 4-Pin; LatestRevisionDate: 17-Jul-2002; LatestRevisionNote: Re-released for DXP Platform.; Publisher: Altium Limited
R17-R31 R33-R35 = Res1: Resistor; Value: 1K; Published: 8-Jun-2000; LatestRevisionDate: 17-Jul-2002; LatestRevisionNote: Re-released for DXP Platform.; PackageReference: AXIAL-0.3; Publisher: Altium Limited; PackageDescription: Axial Device, Thru-Hole; 2 Leads; 0.3 in Pin Spacing
R32 = Res1: Resistor; Published: 8-Jun-2000; LatestRevisionDate: 17-Jul-2002; LatestRevisionNote: Re-released for DXP Platform.; PackageReference: AXIAL-0.3; Publisher: Altium Limited; PackageDescription: Axial Device, Thru-Hole; 2 Leads; 0.3 in Pin Spacing; Value: 1K
RP1 = 8P4R: 贴片排阻; Manufacturer: NC; value: NC
U2 = XNLX-XC7Z020-CLG400: as U2 on sheet ZYNQ_SOC_ARM

## Sheet ZYNQ_SOC_PWR.SchDoc
size A4
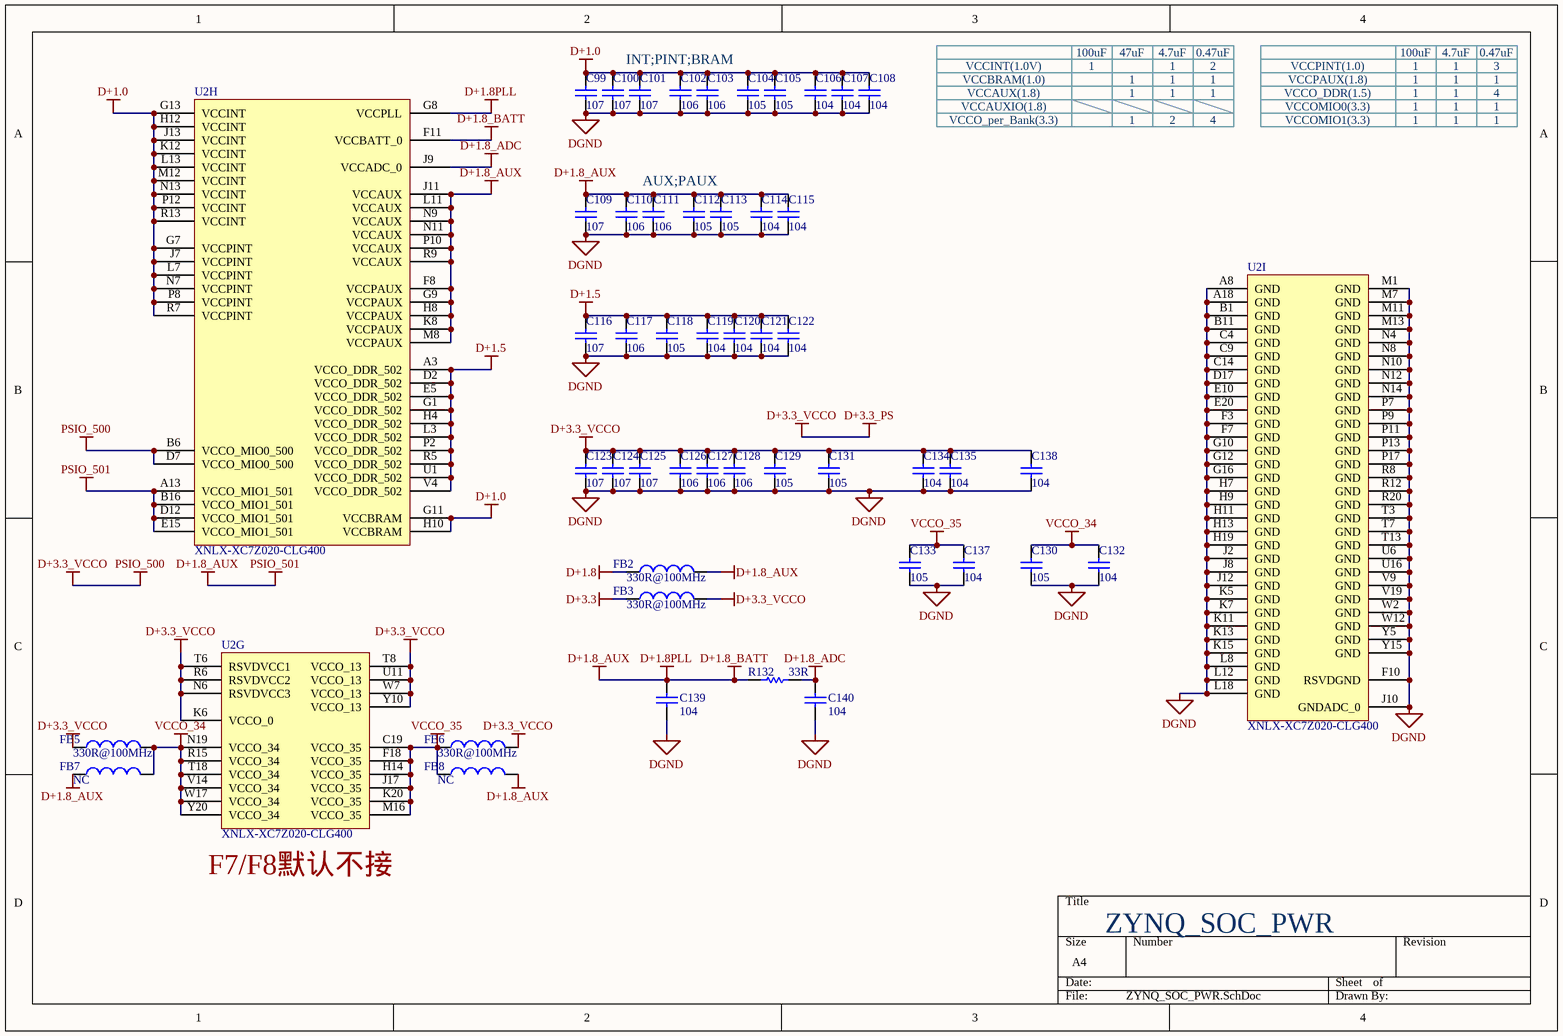
[diagram p5: ZYNQ_SOC_PWR.SchDoc]

### Parts
C99  107  [C 1206_L]
C100  107  [C 1206_L]
C101  107  [C 1206_L]
C102  106  [C 0603_L]
C103  106  [C 0603_L]
C104  105  [C 0402_LL]
C105  105  [C 0402_LL]
C106  104  [C 0402_LL]
C107  104  [C 0402_LL]
C108  104  [C 0402_LL]
C109  107  [C 1206_L]
C110  106  [C 0603_L]
C111  106  [C 0603_L]
C112  105  [C 0402_LL]
C113  105  [C 0402_LL]
C114  104  [C 0402_LL]
C115  104  [C 0402_LL]
C116  107  [C 1206_L]
C117  106  [C 0603_L]
C118  105  [C 0402_LL]
C119  104  [C 0402_LL]
C120  104  [C 0402_LL]
C121  104  [C 0402_LL]
C122  104  [C 0402_LL]
C123  107  [C 1206_L]
C124  107  [C 1206_L]
C125  107  [C 1206_L]
C126  106  [C 0603_L]
C127  106  [C 0603_L]
C128  106  [C 0603_L]
C129  105  [C 0402_LL]
C130  105  [C 0402_LL]
C131  105  [C 0402_LL]
C132  104  [C 0402_LL]
C133  105  [C 0402_LL]
C134  104  [C 0402_LL]
C135  104  [C 0402_LL]
C137  104  [C 0402_LL]
C138  104  [C 0402_LL]
C139  104  [C 0402_LL]
C140  104  [C 0402_LL]
FB2  value 330R@100MHz  [L 0805]  (hidden comment: Ferrite Bead)
FB3  value 330R@100MHz  [L 0805]  (hidden comment: Ferrite Bead)
FB5  value 330R@100MHz  [L 0805]  (hidden comment: Ferrite Bead)
FB6  value 330R@100MHz  [L 0805]  (hidden comment: Ferrite Bead)
FB7  value NC  [L 0805]  (hidden comment: Ferrite Bead)
FB8  value NC  [L 0805]  (hidden comment: Ferrite Bead)
R132  33R  [R 0402_L]
U2  XNLX-XC7Z020-CLG400  [BGA400]  (parts G,H,I of 9)

### Nets
D+1.0: C99.2 C100.2 C101.2 C102.2 C103.2 C104.2 C105.2 C106.2 C107.2 C108.2 U2.G7(VCCPINT) U2.G11(VCCBRAM) U2.G13(VCCINT) U2.H10(VCCBRAM) U2.H12(VCCINT) U2.J7(VCCPINT) U2.J13(VCCINT) U2.K12(VCCINT) U2.L7(VCCPINT) U2.L13(VCCINT) U2.M12(VCCINT) U2.N7(VCCPINT) U2.N13(VCCINT) U2.P8(VCCPINT) U2.P12(VCCINT) U2.R7(VCCPINT) U2.R13(VCCINT)
D+1.5: C116.2 C117.2 C118.2 C119.2 C120.2 C121.2 C122.2 U2.A3(VCCO_DDR_502) U2.D2(VCCO_DDR_502) U2.E5(VCCO_DDR_502) U2.G1(VCCO_DDR_502) U2.H4(VCCO_DDR_502) U2.L3(VCCO_DDR_502) U2.P2(VCCO_DDR_502) U2.R5(VCCO_DDR_502) U2.U1(VCCO_DDR_502) U2.V4(VCCO_DDR_502)
D+1.8: FB2.1
D+1.8_ADC: C140.2 R132.1 U2.J9(VCCADC_0)
D+1.8_AUX: C109.2 C110.2 C111.2 C112.2 C113.2 C114.2 C115.2 C139.2 FB2.2 FB7.1 FB8.2 R132.2 U2.A13(VCCO_MIO1_501) U2.B16(VCCO_MIO1_501) U2.D12(VCCO_MIO1_501) U2.E15(VCCO_MIO1_501) U2.F8(VCCPAUX) U2.F11(VCCBATT_0) U2.G8(VCCPLL) U2.G9(VCCPAUX) U2.H8(VCCPAUX) U2.J11(VCCAUX) U2.K8(VCCPAUX) U2.L11(VCCAUX) U2.M8(VCCPAUX) U2.N9(VCCAUX) U2.N11(VCCAUX) U2.P10(VCCAUX) U2.R9(VCCAUX)  [also labelled D+1.8_BATT, D+1.8PLL, PSIO_501]
D+3.3: FB3.1
D+3.3_PS: C123.2 C124.2 C125.2 C126.2 C127.2 C128.2 C129.2 C131.2 C134.2 C135.2 C138.2 FB3.2 FB5.1 FB6.2 U2.B6(VCCO_MIO0_500) U2.D7(VCCO_MIO0_500) U2.K6(VCCO_0) U2.N6(RSVDVCC3) U2.R6(RSVDVCC2) U2.T6(RSVDVCC1) U2.T8(VCCO_13) U2.U11(VCCO_13) U2.W7(VCCO_13) U2.Y10(VCCO_13)  [also labelled D+3.3_VCCO, PSIO_500]
DGND: C99.1 C100.1 C101.1 C102.1 C103.1 C104.1 C105.1 C106.1 C107.1 C108.1 C109.1 C110.1 C111.1 C112.1 C113.1 C114.1 C115.1 C116.1 C117.1 C118.1 C119.1 C120.1 C121.1 C122.1 C123.1 C124.1 C125.1 C126.1 C127.1 C128.1 C129.1 C130.1 C131.1 C132.1 C133.1 C134.1 C135.1 C137.1 C138.1 C139.1 C140.1 U2.A8(GND) U2.A18(GND) U2.B1(GND) U2.B11(GND) U2.C4(GND) U2.C9(GND) U2.C14(GND) U2.D17(GND) U2.E10(GND) U2.E20(GND) U2.F3(GND) U2.F7(GND) U2.F10(RSVDGND) U2.G10(GND) U2.G12(GND) U2.G16(GND) U2.H7(GND) U2.H9(GND) U2.H11(GND) U2.H13(GND) U2.H19(GND) U2.J2(GND) U2.J8(GND) U2.J10(GNDADC_0) U2.J12(GND) U2.K5(GND) U2.K7(GND) U2.K11(GND) U2.K13(GND) U2.K15(GND) U2.L8(GND) U2.L12(GND) U2.L18(GND) U2.M1(GND) U2.M7(GND) U2.M11(GND) U2.M13(GND) U2.N4(GND) U2.N8(GND) U2.N10(GND) U2.N12(GND) U2.N14(GND) U2.P7(GND) U2.P9(GND) U2.P11(GND) U2.P13(GND) U2.P17(GND) U2.R8(GND) U2.R12(GND) U2.R20(GND) U2.T3(GND) U2.T7(GND) U2.T13(GND) U2.U6(GND) U2.U16(GND) U2.V9(GND) U2.V19(GND) U2.W2(GND) U2.W12(GND) U2.Y5(GND) U2.Y15(GND)
VCCO_34: C130.2 C132.2 FB5.2 FB7.2 U2.N19(VCCO_34) U2.R15(VCCO_34) U2.T18(VCCO_34) U2.V14(VCCO_34) U2.W17(VCCO_34) U2.Y20(VCCO_34)
VCCO_35: C133.2 C137.2 FB6.1 FB8.1 U2.C19(VCCO_35) U2.F18(VCCO_35) U2.H14(VCCO_35) U2.J17(VCCO_35) U2.K20(VCCO_35) U2.M16(VCCO_35)

### Notes on the sheet
- INT;PINT;BRAM
- VCCINT(1.0V)
- VCCBRAM(1.0)
- VCCAUX(1.8)
- VCCAUXIO(1.8)
- VCCO_per_Bank(3.3)
- 100uF
- 1
- 47uF
- 4.7uF
- 2
- 0.47uF
- 4
- VCCPINT(1.0)
- VCCO_DDR(1.5)
- VCCPAUX(1.8)
- VCCOMIO0(3.3)
- VCCOMIO1(3.3)
- 3
- AUX;PAUX
- (near U2) F7/F8默认不接
- ZYNQ_SOC_PWR

### Library data of the parts
C99-C135 C137-C140 = Cap: Capacitor; Published: 8-Jun-2000; LatestRevisionDate: 17-Jul-2002; LatestRevisionNote: Re-released for DXP Platform.; PackageReference: RAD-0.3; Publisher: Altium Limited; PackageDescription: Radial Cap, Thru-Hole; 2 Leads; 0.3 in Pin Spacing
FB2 FB3 FB5-FB8 = Inductor: Code_IEC: 1005; Published: 8-Jun-2000; LatestRevisionDate: 29-May-2009; LatestRevisionNote: IPC-7351 Footprint Added.; PackageReference: 0402-A; Publisher: Altium Limited; PackageDescription: Chip Inductor; Code_JEITA: 0402
R132 = Res1: Resistor; Value: 1K; Published: 8-Jun-2000; LatestRevisionDate: 17-Jul-2002; LatestRevisionNote: Re-released for DXP Platform.; PackageReference: AXIAL-0.3; Publisher: Altium Limited; PackageDescription: Axial Device, Thru-Hole; 2 Leads; 0.3 in Pin Spacing
U2 = XNLX-XC7Z020-CLG400: as U2 on sheet ZYNQ_SOC_ARM

## Sheet EX_IO.SchDoc
size A4
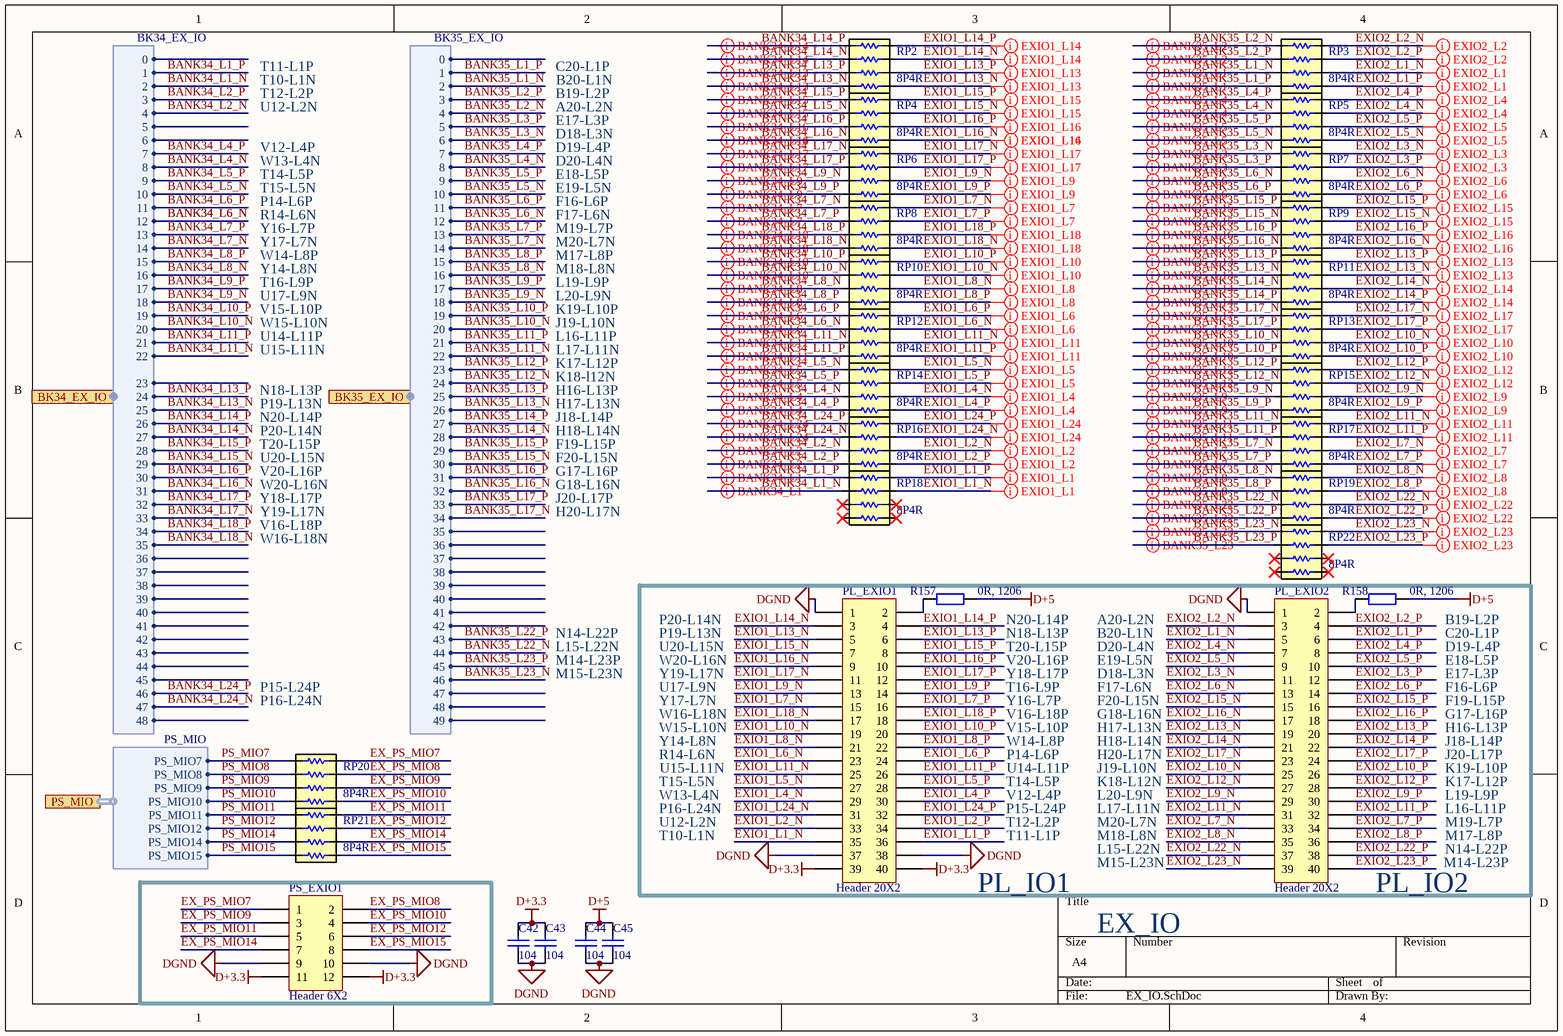
[diagram p6: EX_IO.SchDoc]

### Parts
C42  104  [C 0402_LL]
C43  104  [C 0402_LL]
C44  104  [C 0402_LL]
C45  104  [C 0402_LL]
PL_EXIO1  Header 20X2  [HDR2.54-LI-2x20P]
PL_EXIO2  Header 20X2  [HDR2.54-LI-2x20P]
PS_EXIO1  Header 6X2  [HDR2X6]
R157  0R, 1206  [R 1206_L]
R158  0R, 1206  [R 1206_L]
RP2  8P4R  [8P4R]
RP3  8P4R  [8P4R]
RP4  8P4R  [8P4R]
RP5  8P4R  [8P4R]
RP6  8P4R  [8P4R]
RP7  8P4R  [8P4R]
RP8  8P4R  [8P4R]
RP9  8P4R  [8P4R]
RP10  8P4R  [8P4R]
RP11  8P4R  [8P4R]
RP12  8P4R  [8P4R]
RP13  8P4R  [8P4R]
RP14  8P4R  [8P4R]
RP15  8P4R  [8P4R]
RP16  8P4R  [8P4R]
RP17  8P4R  [8P4R]
RP18  8P4R  [8P4R]
RP19  8P4R  [8P4R]
RP20  8P4R  [8P4R]
RP21  8P4R  [8P4R]
RP22  8P4R  [8P4R]

### Ports
BK34_EX_IO (harness BK34_EX_IO), BK35_EX_IO (harness BK35_EX_IO), PS_MIO (harness PS_MIO)

### Harnesses
BK35_EX_IO: 0, 1, 2, 3, 4, 5, 6, 7, 8, 9, 10, 11, 12, 13, 14, 15, 16, 17, 18, 19, 20, 21, 22, 23, 24, 25, 26, 27, 28, 29, 30, 31, 32, 33, 34, 35, 36, 37, 38, 39, 40, 41, 42, 43, 44, 45, 46, 47, 48, 49
PS_MIO: PS_MIO7, PS_MIO8, PS_MIO9, PS_MIO10, PS_MIO11, PS_MIO12, PS_MIO14, PS_MIO15
BK34_EX_IO: 0, 1, 2, 3, 4, 5, 6, 7, 8, 9, 10, 11, 12, 13, 14, 15, 16, 17, 18, 19, 20, 21, 22, 23, 24, 25, 26, 27, 28, 29, 30, 31, 32, 33, 34, 35, 36, 37, 38, 39, 40, 41, 42, 43, 44, 45, 46, 47, 48

### Nets
D+3.3: C42.1 C43.1 PL_EXIO1.39 PL_EXIO1.40 PS_EXIO1.11 PS_EXIO1.12
D+5: C44.1 C45.1 R157.2 R158.2
DGND: C42.2 C43.2 C44.2 C45.2 PL_EXIO1.1 PL_EXIO1.37 PL_EXIO1.38 PL_EXIO2.1 PS_EXIO1.9 PS_EXIO1.10
BANK34_L1_N: RP18.2 ; port BK34_EX_IO.2
BANK34_L1_P: RP18.1 ; port BK34_EX_IO.1
BANK34_L2_N: RP16.3 ; port BK34_EX_IO.4
BANK34_L2_P: RP16.4 ; port BK34_EX_IO.3
BANK34_L4_N: RP14.3 ; port BK34_EX_IO.8
BANK34_L4_P: RP14.4 ; port BK34_EX_IO.7
BANK34_L5_N: RP14.1 ; port BK34_EX_IO.10
BANK34_L5_P: RP14.2 ; port BK34_EX_IO.9
BANK34_L6_N: RP12.2 ; port BK34_EX_IO.12
BANK34_L6_P: RP12.1 ; port BK34_EX_IO.11
BANK34_L7_N: RP8.1 ; port BK34_EX_IO.14
BANK34_L7_P: RP8.2 ; port BK34_EX_IO.13
BANK34_L8_N: RP10.3 ; port BK34_EX_IO.16
BANK34_L8_P: RP10.4 ; port BK34_EX_IO.15
BANK34_L9_N: RP6.3 ; port BK34_EX_IO.18
BANK34_L9_P: RP6.4 ; port BK34_EX_IO.17
BANK34_L10_N: RP10.2 ; port BK34_EX_IO.20
BANK34_L10_P: RP10.1 ; port BK34_EX_IO.19
BANK34_L11_N: RP12.3 ; port BK34_EX_IO.22
BANK34_L11_P: RP12.4 ; port BK34_EX_IO.21
BANK34_L13_N: RP2.4 ; port BK34_EX_IO.25
BANK34_L13_P: RP2.3 ; port BK34_EX_IO.24
BANK34_L14_N: RP2.2 ; port BK34_EX_IO.27
BANK34_L14_P: RP2.1 ; port BK34_EX_IO.26
BANK34_L15_N: RP4.2 ; port BK34_EX_IO.29
BANK34_L15_P: RP4.1 ; port BK34_EX_IO.28
BANK34_L16_N: RP4.4 ; port BK34_EX_IO.31
BANK34_L16_P: RP4.3 ; port BK34_EX_IO.30
BANK34_L17_N: RP6.1 ; port BK34_EX_IO.33
BANK34_L17_P: RP6.2 ; port BK34_EX_IO.32
BANK34_L18_N: RP8.4 ; port BK34_EX_IO.35
BANK34_L18_P: RP8.3 ; port BK34_EX_IO.34
BANK34_L24_N: RP16.2 ; port BK34_EX_IO.47
BANK34_L24_P: RP16.1 ; port BK34_EX_IO.46
BANK35_L1_N: RP3.3 ; port BK35_EX_IO.2
BANK35_L1_P: RP3.4 ; port BK35_EX_IO.1
BANK35_L2_N: RP3.1 ; port BK35_EX_IO.4
BANK35_L2_P: RP3.2 ; port BK35_EX_IO.3
BANK35_L3_N: RP7.1 ; port BK35_EX_IO.6
BANK35_L3_P: RP7.2 ; port BK35_EX_IO.5
BANK35_L4_N: RP5.2 ; port BK35_EX_IO.8
BANK35_L4_P: RP5.1 ; port BK35_EX_IO.7
BANK35_L5_N: RP5.4 ; port BK35_EX_IO.10
BANK35_L5_P: RP5.3 ; port BK35_EX_IO.9
BANK35_L6_N: RP7.3 ; port BK35_EX_IO.12
BANK35_L6_P: RP7.4 ; port BK35_EX_IO.11
BANK35_L7_N: RP17.3 ; port BK35_EX_IO.14
BANK35_L7_P: RP17.4 ; port BK35_EX_IO.13
BANK35_L8_N: RP19.1 ; port BK35_EX_IO.16
BANK35_L8_P: RP19.2 ; port BK35_EX_IO.15
BANK35_L9_N: RP15.3 ; port BK35_EX_IO.18
BANK35_L9_P: RP15.4 ; port BK35_EX_IO.17
BANK35_L10_N: RP13.3 ; port BK35_EX_IO.20
BANK35_L10_P: RP13.4 ; port BK35_EX_IO.19
BANK35_L11_N: RP17.1 ; port BK35_EX_IO.22
BANK35_L11_P: RP17.2 ; port BK35_EX_IO.21
BANK35_L12_N: RP15.2 ; port BK35_EX_IO.24
BANK35_L12_P: RP15.1 ; port BK35_EX_IO.23
BANK35_L13_N: RP11.2 ; port BK35_EX_IO.26
BANK35_L13_P: RP11.1 ; port BK35_EX_IO.25
BANK35_L14_N: RP11.3 ; port BK35_EX_IO.28
BANK35_L14_P: RP11.4 ; port BK35_EX_IO.27
BANK35_L15_N: RP9.2 ; port BK35_EX_IO.30
BANK35_L15_P: RP9.1 ; port BK35_EX_IO.29
BANK35_L16_N: RP9.4 ; port BK35_EX_IO.32
BANK35_L16_P: RP9.3 ; port BK35_EX_IO.31
BANK35_L17_N: RP13.1 ; port BK35_EX_IO.34
BANK35_L17_P: RP13.2 ; port BK35_EX_IO.33
BANK35_L22_N: RP19.3 ; port BK35_EX_IO.44
BANK35_L22_P: RP19.4 ; port BK35_EX_IO.43
BANK35_L23_N: RP22.1 ; port BK35_EX_IO.46
BANK35_L23_P: RP22.2 ; port BK35_EX_IO.45
EX_PS_MIO7: PS_EXIO1.1 RP20.5
EX_PS_MIO8: PS_EXIO1.2 RP20.6
EX_PS_MIO9: PS_EXIO1.3 RP20.7
EX_PS_MIO10: PS_EXIO1.4 RP20.8
EX_PS_MIO11: PS_EXIO1.5 RP21.5
EX_PS_MIO12: PS_EXIO1.6 RP21.6
EX_PS_MIO14: PS_EXIO1.7 RP21.7
EX_PS_MIO15: PS_EXIO1.8 RP21.8
EXIO1_L1_N: PL_EXIO1.35 RP18.6
EXIO1_L1_P: PL_EXIO1.36 RP18.5
EXIO1_L2_N: PL_EXIO1.33 RP16.7
EXIO1_L2_P: PL_EXIO1.34 RP16.8
EXIO1_L4_N: PL_EXIO1.29 RP14.7
EXIO1_L4_P: PL_EXIO1.30 RP14.8
EXIO1_L5_N: PL_EXIO1.27 RP14.5
EXIO1_L5_P: PL_EXIO1.28 RP14.6
EXIO1_L6_N: PL_EXIO1.23 RP12.6
EXIO1_L6_P: PL_EXIO1.24 RP12.5
EXIO1_L7_N: PL_EXIO1.15 RP8.5
EXIO1_L7_P: PL_EXIO1.16 RP8.6
EXIO1_L8_N: PL_EXIO1.21 RP10.7
EXIO1_L8_P: PL_EXIO1.22 RP10.8
EXIO1_L9_N: PL_EXIO1.13 RP6.7
EXIO1_L9_P: PL_EXIO1.14 RP6.8
EXIO1_L10_N: PL_EXIO1.19 RP10.6
EXIO1_L10_P: PL_EXIO1.20 RP10.5
EXIO1_L11_N: PL_EXIO1.25 RP12.7
EXIO1_L11_P: PL_EXIO1.26 RP12.8
EXIO1_L13_N: PL_EXIO1.5 RP2.8
EXIO1_L13_P: PL_EXIO1.6 RP2.7
EXIO1_L14_N: PL_EXIO1.3 RP2.6
EXIO1_L14_P: PL_EXIO1.4 RP2.5
EXIO1_L15_N: PL_EXIO1.7 RP4.6
EXIO1_L15_P: PL_EXIO1.8 RP4.5
EXIO1_L16_N: PL_EXIO1.9 RP4.8
EXIO1_L16_P: PL_EXIO1.10 RP4.7
EXIO1_L17_N: PL_EXIO1.11 RP6.5
EXIO1_L17_P: PL_EXIO1.12 RP6.6
EXIO1_L18_N: PL_EXIO1.17 RP8.8
EXIO1_L18_P: PL_EXIO1.18 RP8.7
EXIO1_L24_N: PL_EXIO1.31 RP16.6
EXIO1_L24_P: PL_EXIO1.32 RP16.5
EXIO2_L1_N: PL_EXIO2.5 RP3.7
EXIO2_L1_P: PL_EXIO2.6 RP3.8
EXIO2_L2_N: PL_EXIO2.3 RP3.5
EXIO2_L2_P: PL_EXIO2.4 RP3.6
EXIO2_L3_N: PL_EXIO2.11 RP7.5
EXIO2_L3_P: PL_EXIO2.12 RP7.6
EXIO2_L4_N: PL_EXIO2.7 RP5.6
EXIO2_L4_P: PL_EXIO2.8 RP5.5
EXIO2_L5_N: PL_EXIO2.9 RP5.8
EXIO2_L5_P: PL_EXIO2.10 RP5.7
EXIO2_L6_N: PL_EXIO2.13 RP7.7
EXIO2_L6_P: PL_EXIO2.14 RP7.8
EXIO2_L7_N: PL_EXIO2.33 RP17.7
EXIO2_L7_P: PL_EXIO2.34 RP17.8
EXIO2_L8_N: PL_EXIO2.35 RP19.5
EXIO2_L8_P: PL_EXIO2.36 RP19.6
EXIO2_L9_N: PL_EXIO2.29 RP15.7
EXIO2_L9_P: PL_EXIO2.30 RP15.8
EXIO2_L10_N: PL_EXIO2.25 RP13.7
EXIO2_L10_P: PL_EXIO2.26 RP13.8
EXIO2_L11_N: PL_EXIO2.31 RP17.5
EXIO2_L11_P: PL_EXIO2.32 RP17.6
EXIO2_L12_N: PL_EXIO2.27 RP15.6
EXIO2_L12_P: PL_EXIO2.28 RP15.5
EXIO2_L13_N: PL_EXIO2.19 RP11.6
EXIO2_L13_P: PL_EXIO2.20 RP11.5
EXIO2_L14_N: PL_EXIO2.21 RP11.7
EXIO2_L14_P: PL_EXIO2.22 RP11.8
EXIO2_L15_N: PL_EXIO2.15 RP9.6
EXIO2_L15_P: PL_EXIO2.16 RP9.5
EXIO2_L16_N: PL_EXIO2.17 RP9.8
EXIO2_L16_P: PL_EXIO2.18 RP9.7
EXIO2_L17_N: PL_EXIO2.23 RP13.5
EXIO2_L17_P: PL_EXIO2.24 RP13.6
EXIO2_L22_N: PL_EXIO2.37 RP19.7
EXIO2_L22_P: PL_EXIO2.38 RP19.8
EXIO2_L23_N: PL_EXIO2.39 RP22.5
EXIO2_L23_P: PL_EXIO2.40 RP22.6
PS_MIO7: RP20.1 ; port PS_MIO.PS_MIO7
PS_MIO8: RP20.2 ; port PS_MIO.PS_MIO8
PS_MIO9: RP20.3 ; port PS_MIO.PS_MIO9
PS_MIO10: RP20.4 ; port PS_MIO.PS_MIO10
PS_MIO11: RP21.1 ; port PS_MIO.PS_MIO11
PS_MIO12: RP21.2 ; port PS_MIO.PS_MIO12
PS_MIO14: RP21.3 ; port PS_MIO.PS_MIO14
PS_MIO15: RP21.4 ; port PS_MIO.PS_MIO15
NetPL_EXIO1_2: PL_EXIO1.2 R157.1
NetPL_EXIO2_2: PL_EXIO2.2 R158.1

Not connected (* = marked no-connect by the designer): RP18 3* 4* 7* 8*; RP22 3* 4* 7* 8*

### Layout directives
differential pair: BANK34_L1_N, BANK34_L1_P, BANK34_L2_N, BANK34_L2_P, BANK34_L4_N, BANK34_L4_P, BANK34_L5_N, BANK34_L5_P, BANK34_L6_N, BANK34_L6_P, BANK34_L7_N, BANK34_L7_P, BANK34_L8_N, BANK34_L8_P, BANK34_L9_N, BANK34_L9_P, BANK34_L10_N, BANK34_L10_P, BANK34_L11_N, BANK34_L11_P, BANK34_L13_N, BANK34_L13_P, BANK34_L14_N, BANK34_L14_P, BANK34_L15_N, BANK34_L15_P, BANK34_L16_N, BANK34_L16_P, BANK34_L17_N, BANK34_L17_P, BANK34_L18_N, BANK34_L18_P, BANK34_L24_N, BANK34_L24_P, BANK35_L1_N, BANK35_L1_P, BANK35_L2_N, BANK35_L2_P, BANK35_L3_N, BANK35_L3_P, BANK35_L4_N, BANK35_L4_P, BANK35_L5_N, BANK35_L5_P, BANK35_L6_N, BANK35_L6_P, BANK35_L7_N, BANK35_L7_P, BANK35_L8_N, BANK35_L8_P, BANK35_L9_N, BANK35_L9_P, BANK35_L10_N, BANK35_L10_P, BANK35_L11_N, BANK35_L11_P, BANK35_L12_N, BANK35_L12_P, BANK35_L13_N, BANK35_L13_P, BANK35_L14_N, BANK35_L14_P, BANK35_L15_N, BANK35_L15_P, BANK35_L16_N, BANK35_L16_P, BANK35_L17_N, BANK35_L17_P, BANK35_L22_N, BANK35_L22_P, BANK35_L23_N, BANK35_L23_P, EXIO1_L1_N, EXIO1_L1_P, EXIO1_L2_N, EXIO1_L2_P, EXIO1_L4_N, EXIO1_L4_P, EXIO1_L5_N, EXIO1_L5_P, EXIO1_L6_N, EXIO1_L6_P, EXIO1_L7_N, EXIO1_L7_P, EXIO1_L8_N, EXIO1_L8_P, EXIO1_L9_N, EXIO1_L9_P, EXIO1_L10_N, EXIO1_L10_P, EXIO1_L11_N, EXIO1_L11_P, EXIO1_L13_N, EXIO1_L13_P, EXIO1_L14_N, EXIO1_L14_P, EXIO1_L15_N, EXIO1_L15_P, EXIO1_L16_N, EXIO1_L16_P, EXIO1_L17_N, EXIO1_L17_P, EXIO1_L18_N, EXIO1_L18_P, EXIO1_L24_N, EXIO1_L24_P, EXIO2_L1_N, EXIO2_L1_P, EXIO2_L2_N, EXIO2_L2_P, EXIO2_L3_N, EXIO2_L3_P, EXIO2_L4_N, EXIO2_L4_P, EXIO2_L5_N, EXIO2_L5_P, EXIO2_L6_N, EXIO2_L6_P, EXIO2_L7_N, EXIO2_L7_P, EXIO2_L8_N, EXIO2_L8_P, EXIO2_L9_N, EXIO2_L9_P, EXIO2_L10_N, EXIO2_L10_P, EXIO2_L11_N, EXIO2_L11_P, EXIO2_L12_N, EXIO2_L12_P, EXIO2_L13_N, EXIO2_L13_P, EXIO2_L14_N, EXIO2_L14_P, EXIO2_L15_N, EXIO2_L15_P, EXIO2_L16_N, EXIO2_L16_P, EXIO2_L17_N, EXIO2_L17_P, EXIO2_L22_N, EXIO2_L22_P, EXIO2_L23_N, EXIO2_L23_P

### Notes on the sheet
- T11-L1P
- T12-L2P
- T10-L1N
- U12-L2N
- E17-L3P
- B19-L2P
- C20-L1P
- B20-L1N
- A20-L2N
- T14-L5P
- V12-L4P
- W13-L4N
- E18-L5P
- D19-L4P
- D18-L3N
- D20-L4N
- P14-L6P
- Y16-L7P
- T15-L5N
- R14-L6N
- Y17-L7N
- W14-L8P
- F16-L6P
- F17-L6N
- E19-L5N
- M19-L7P
- M17-L8P
- M20-L7N
- T16-L9P
- Y14-L8N
- U17-L9N
- V15-L10P
- L19-L9P
- L20-L9N
- M18-L8N
- K19-L10P
- U14-L11P
- N18-L13P
- U15-L11N
- W15-L10N
- J19-L10N
- K18-l12N
- L16-L11P
- K17-L12P
- H16-L13P
- L17-L11N
- T20-L15P
- N20-L14P
- P19-L13N
- P20-L14N
- J18-L14P
- F19-L15P
- H17-L13N
- H18-L14N
- V20-L16P
- Y18-L17P
- V16-L18P
- U20-L15N
- Y19-L17N
- W20-L16N
- J20-L17P
- G17-L16P
- F20-L15N
- G18-L16N
- H20-L17N
- W16-L18N
- N14-L22P
- L15-L22N
- M14-L23P
- (near R157) N18-L13P
- (near R157) N20-L14P
- (near R158) B19-L2P
- P15-L24P
- (near RP20) P16-L24N
- M15-L23N
- K18-L12N
- P16-L24N
- PL_IO1
- EX_IO
- (near PL_EXIO2) PL_IO2

### Library data of the parts
C42-C45 = Cap: Capacitor; Published: 8-Jun-2000; LatestRevisionDate: 17-Jul-2002; LatestRevisionNote: Re-released for DXP Platform.; PackageReference: RAD-0.3; Publisher: Altium Limited; PackageDescription: Radial Cap, Thru-Hole; 2 Leads; 0.3 in Pin Spacing
PL_EXIO1 PL_EXIO2 = Header 20X2: Header, 20-Pin, Dual row; LatestRevisionDate: 17-Jul-2002; LatestRevisionNote: Re-released for DXP Platform.; Publisher: Altium Limited
PS_EXIO1 = Header 6X2: Header, 6-Pin, Dual row; LatestRevisionDate: 17-Jul-2002; LatestRevisionNote: Re-released for DXP Platform.; Publisher: Altium Limited
R157 R158 = Res2: Resistor; Value: RES; Published: 8-Jun-2000; LatestRevisionDate: 17-Jul-2002; LatestRevisionNote: Re-released for DXP Platform.; PackageReference: AXIAL-0.4; Publisher: Altium Limited; PackageDescription: Axial Device, Thru-Hole; 2 Leads; 0.4 in Pin Spacing
RP2-RP22 = 8P4R: 贴片排阻; Manufacturer: NC; value: NC

## Sheet FLASH.SchDoc
size A4
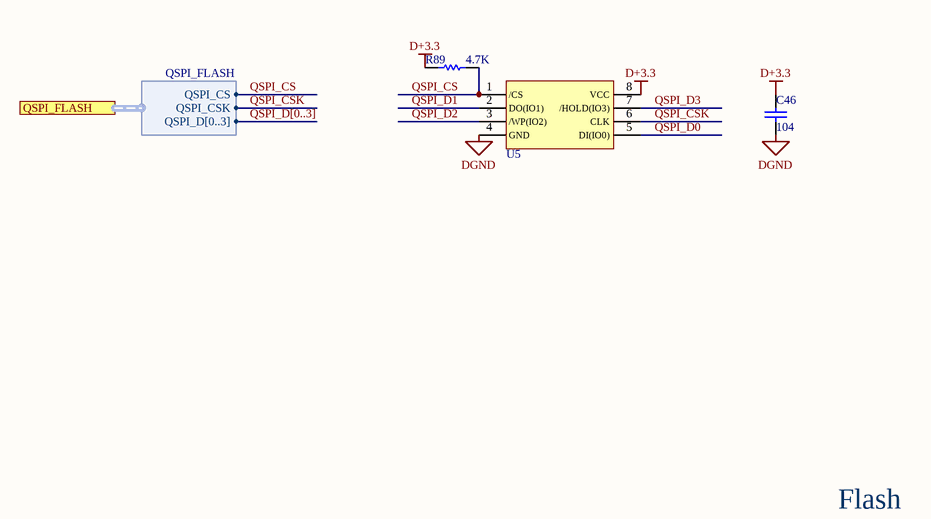
[diagram p7: FLASH.SchDoc]

### Parts
C46  104  [C 0402_LL]
R89  4.7K  [R 0603_L]
U5  W25Q128  [SOP8W_L]  (value not drawn)

### Ports
QSPI_FLASH (harness QSPI_FLASH)

### Harnesses
QSPI_FLASH: QSPI_CS, QSPI_CSK, QSPI_D[0..3]

### Nets
D+3.3: C46.2 R89.2 U5.8(VCC)
DGND: C46.1 U5.4(GND)
QSPI_CS: R89.1 U5.1(/CS) ; port QSPI_FLASH.QSPI_CS
QSPI_CSK: U5.6(CLK) ; port QSPI_FLASH.QSPI_CSK
QSPI_D0: U5.5(DI(IO0))
QSPI_D1: U5.2(DO(IO1))
QSPI_D2: U5.3(/WP(IO2))
QSPI_D3: U5.7(/HOLD(IO3))

### Buses and harness runs
bus QSPI_D[0..3]

### Notes on the sheet
- Flash

### Library data of the parts
C46 = Cap: Capacitor; Published: 8-Jun-2000; LatestRevisionDate: 17-Jul-2002; LatestRevisionNote: Re-released for DXP Platform.; PackageReference: RAD-0.3; Publisher: Altium Limited; PackageDescription: Radial Cap, Thru-Hole; 2 Leads; 0.3 in Pin Spacing
R89 = Res1: Resistor; Value: 1K; Published: 8-Jun-2000; LatestRevisionDate: 17-Jul-2002; LatestRevisionNote: Re-released for DXP Platform.; PackageReference: AXIAL-0.3; Publisher: Altium Limited; PackageDescription: Axial Device, Thru-Hole; 2 Leads; 0.3 in Pin Spacing